# EAGLE design Tarjeta_Prototipo_L6470 (EAGLE 7.6.0)

## Sheet 1 of 7
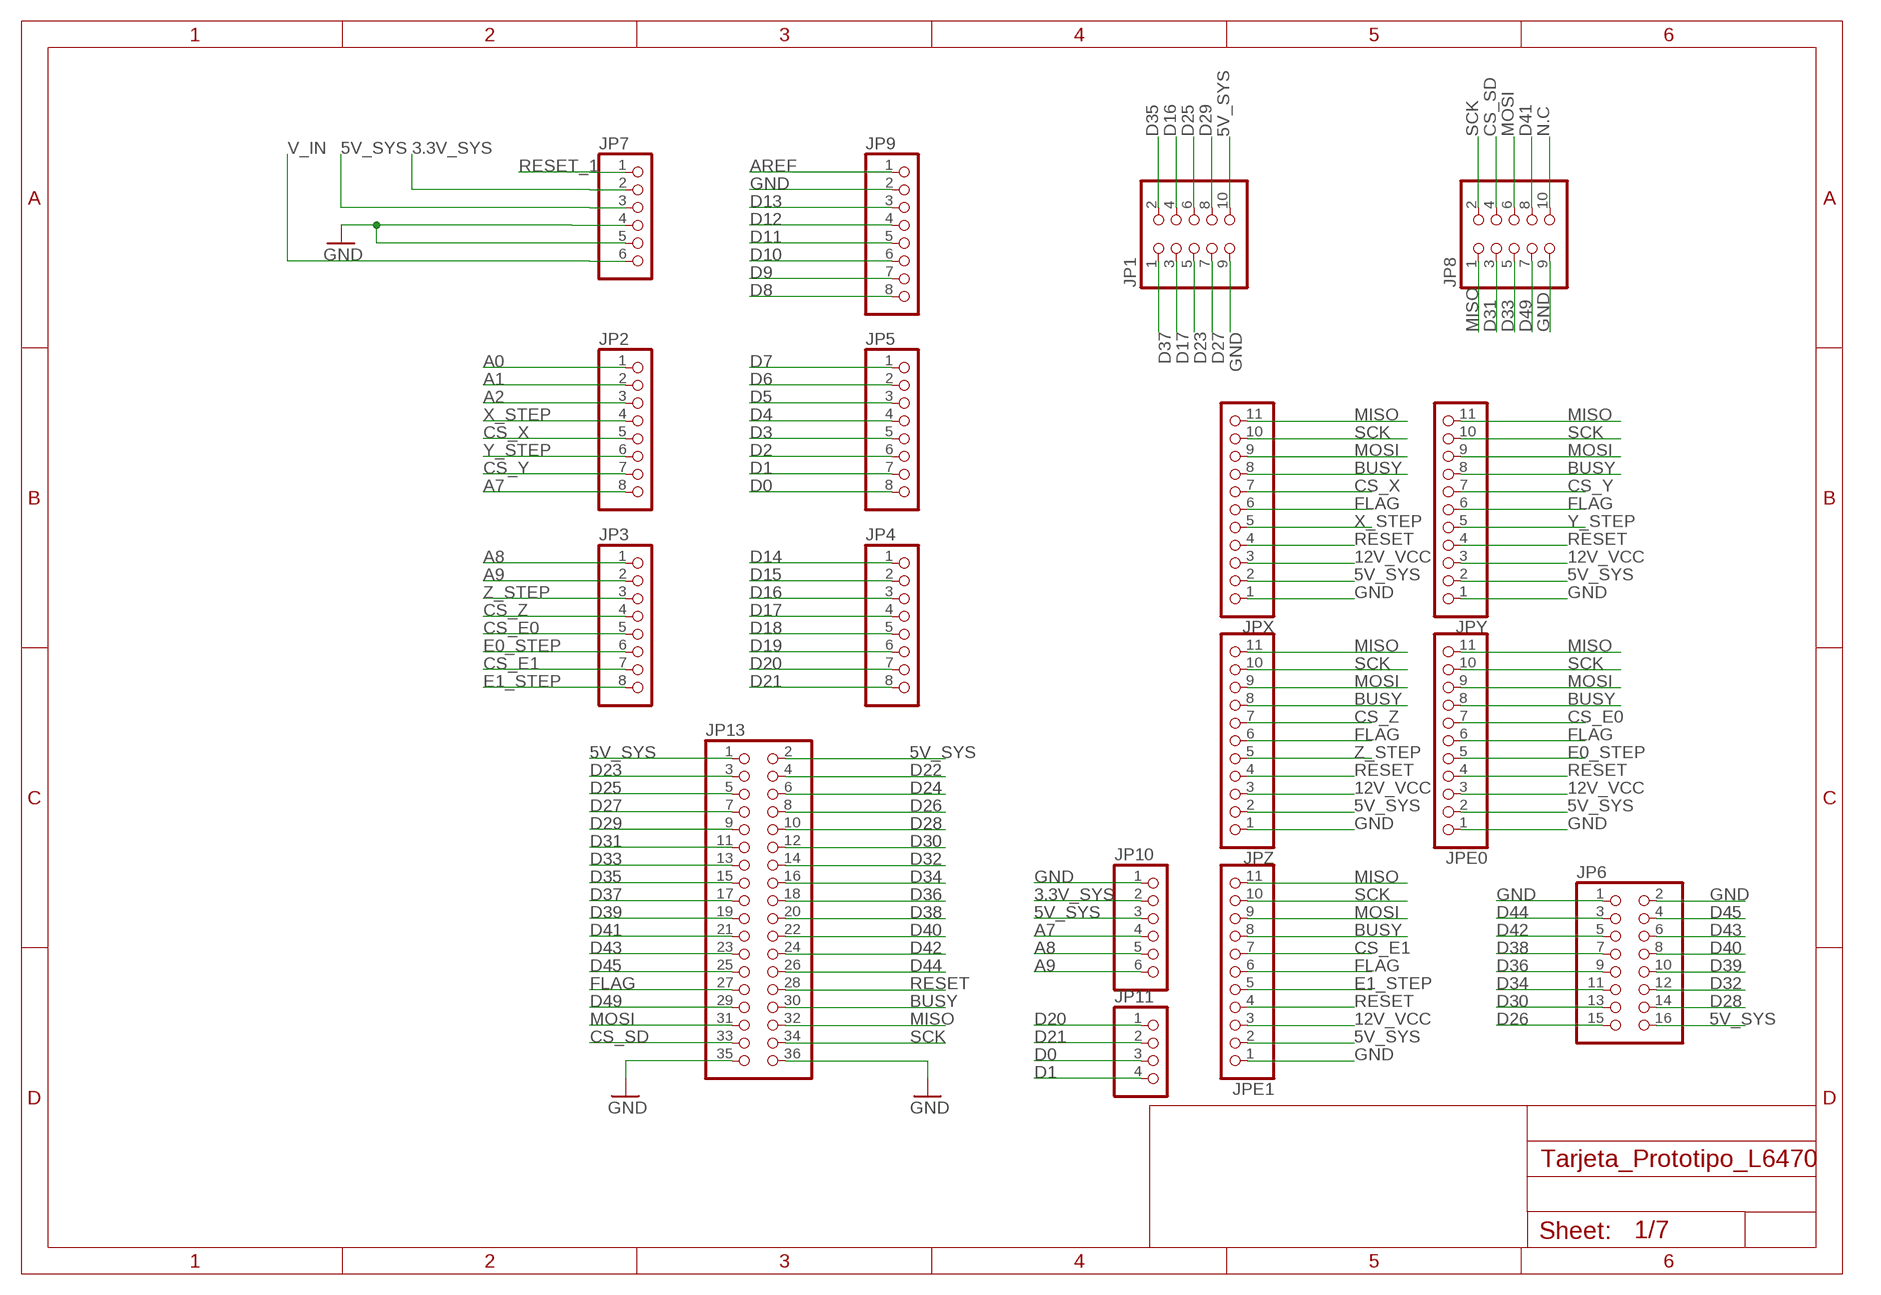
[diagram p0: schematic, sheet 1]

### Parts
JP1  PINHD-2X5  [2X05]
JP2  PINHD-1X8  [1X08]
JP3  PINHD-1X8  [1X08]
JP4  PINHD-1X8  [1X08]
JP5  PINHD-1X8  [1X08]
JP6  PINHD-2X8  [2X08]
JP7  PINHD-1X6  [1X06]
JP8  PINHD-2X5  [2X05]
JP9  PINHD-1X8  [1X08]
JP10  PINHD-1X6  [1X06]
JP11  PINHD-1X4  [1X04]
JP13  PINHD-2X18  [2X18]
JPE0  PINHD-1X11  [1X11]
JPE1  PINHD-1X11  [1X11]
JPX  PINHD-1X11  [1X11]
JPY  PINHD-1X11  [1X11]
JPZ  PINHD-1X11  [1X11]

### Nets
3.3V_SYS: JP7.2 JP10.2
5V_SYS: JP1.10 JP6.16 JP7.3 JP10.3 JP13.1 JP13.2 JPE0.2 JPE1.2 JPX.2 JPY.2 JPZ.2 ; also sheet 3
12V_VCC: JPE0.3 JPE1.3 JPX.3 JPY.3 JPZ.3 ; also sheet 2,5,7
A0: JP2.1 ; also sheet 3
A1: JP2.2 ; also sheet 3
A2: JP2.3 ; also sheet 3
A7: JP2.8 JP10.4
A8: JP3.1 JP10.5
A9: JP3.2 JP10.6
AREF: JP9.1
BUSY: JP13.30 JPE0.8 JPE1.8 JPX.8 JPY.8 JPZ.8
CS_E0: JP3.5 JPE0.7
CS_E1: JP3.7 JPE1.7
CS_SD: JP8.4 JP13.33
CS_X: JP2.5 JPX.7
CS_Y: JP2.7 JPY.7
CS_Z: JP3.4 JPZ.7
D0: JP5.8 JP11.3
D1: JP5.7 JP11.4
D2: JP5.6 ; also sheet 6
D3: JP5.5 ; also sheet 6
D4: JP5.4 ; also sheet 6
D5: JP5.3 ; also sheet 6
D6: JP5.2 ; also sheet 4
D7: JP5.1 ; also sheet 4
D8: JP9.8 ; also sheet 4
D9: JP9.7 ; also sheet 3
D10: JP9.6 ; also sheet 3
D11: JP9.5 ; also sheet 3
D12: JP9.4 ; also sheet 3
D13: JP9.3 ; also sheet 2
D14: JP4.1 ; also sheet 3
D15: JP4.2 ; also sheet 3
D16: JP1.4 JP4.3
D17: JP1.3 JP4.4
D18: JP4.5 ; also sheet 3
D19: JP4.6 ; also sheet 3
D20: JP4.7 JP11.1
D21: JP4.8 JP11.2
D22: JP13.4 ; also sheet 3
D23: JP1.5 JP13.3
D24: JP13.6 ; also sheet 3
D25: JP1.6 JP13.5
D26: JP6.15 JP13.8
D27: JP1.7 JP13.7
D28: JP6.14 JP13.10
D29: JP1.8 JP13.9
D30: JP6.13 JP13.12
D31: JP8.3 JP13.11
D32: JP6.12 JP13.14
D33: JP8.5 JP13.13
D34: JP6.11 JP13.16
D35: JP1.2 JP13.15
D36: JP6.9 JP13.18
D37: JP1.1 JP13.17
D38: JP6.7 JP13.20
D39: JP6.10 JP13.19
D40: JP6.8 JP13.22
D41: JP8.8 JP13.21
D42: JP6.5 JP13.24
D43: JP6.6 JP13.23
D44: JP6.3 JP13.26
D45: JP6.4 JP13.25
D49: JP8.7 JP13.29
E0_STEP: JP3.6 JPE0.5
E1_STEP: JP3.8 JPE1.5
FLAG: JP13.27 JPE0.6 JPE1.6 JPX.6 JPY.6 JPZ.6
GND: JP1.9 JP6.1 JP6.2 JP7.4 JP7.5 JP8.9 JP9.2 JP10.1 JP13.35 JP13.36 JPE0.1 JPE1.1 JPX.1 JPY.1 JPZ.1 ; also sheet 2,3,4,5,6,7
MISO: JP8.1 JP13.32 JPE0.11 JPE1.11 JPX.11 JPY.11 JPZ.11
MOSI: JP8.6 JP13.31 JPE0.9 JPE1.9 JPX.9 JPY.9 JPZ.9
N.C: JP8.10
RESET: JP13.28 JPE0.4 JPE1.4 JPX.4 JPY.4 JPZ.4
RESET_1: JP7.1 ; also sheet 2
SCK: JP8.2 JP13.34 JPE0.10 JPE1.10 JPX.10 JPY.10 JPZ.10
V_IN: JP7.6 ; also sheet 2,4,6
X_STEP: JP2.4 JPX.5
Y_STEP: JP2.6 JPY.5
Z_STEP: JP3.3 JPZ.5

## Sheet 2 of 7
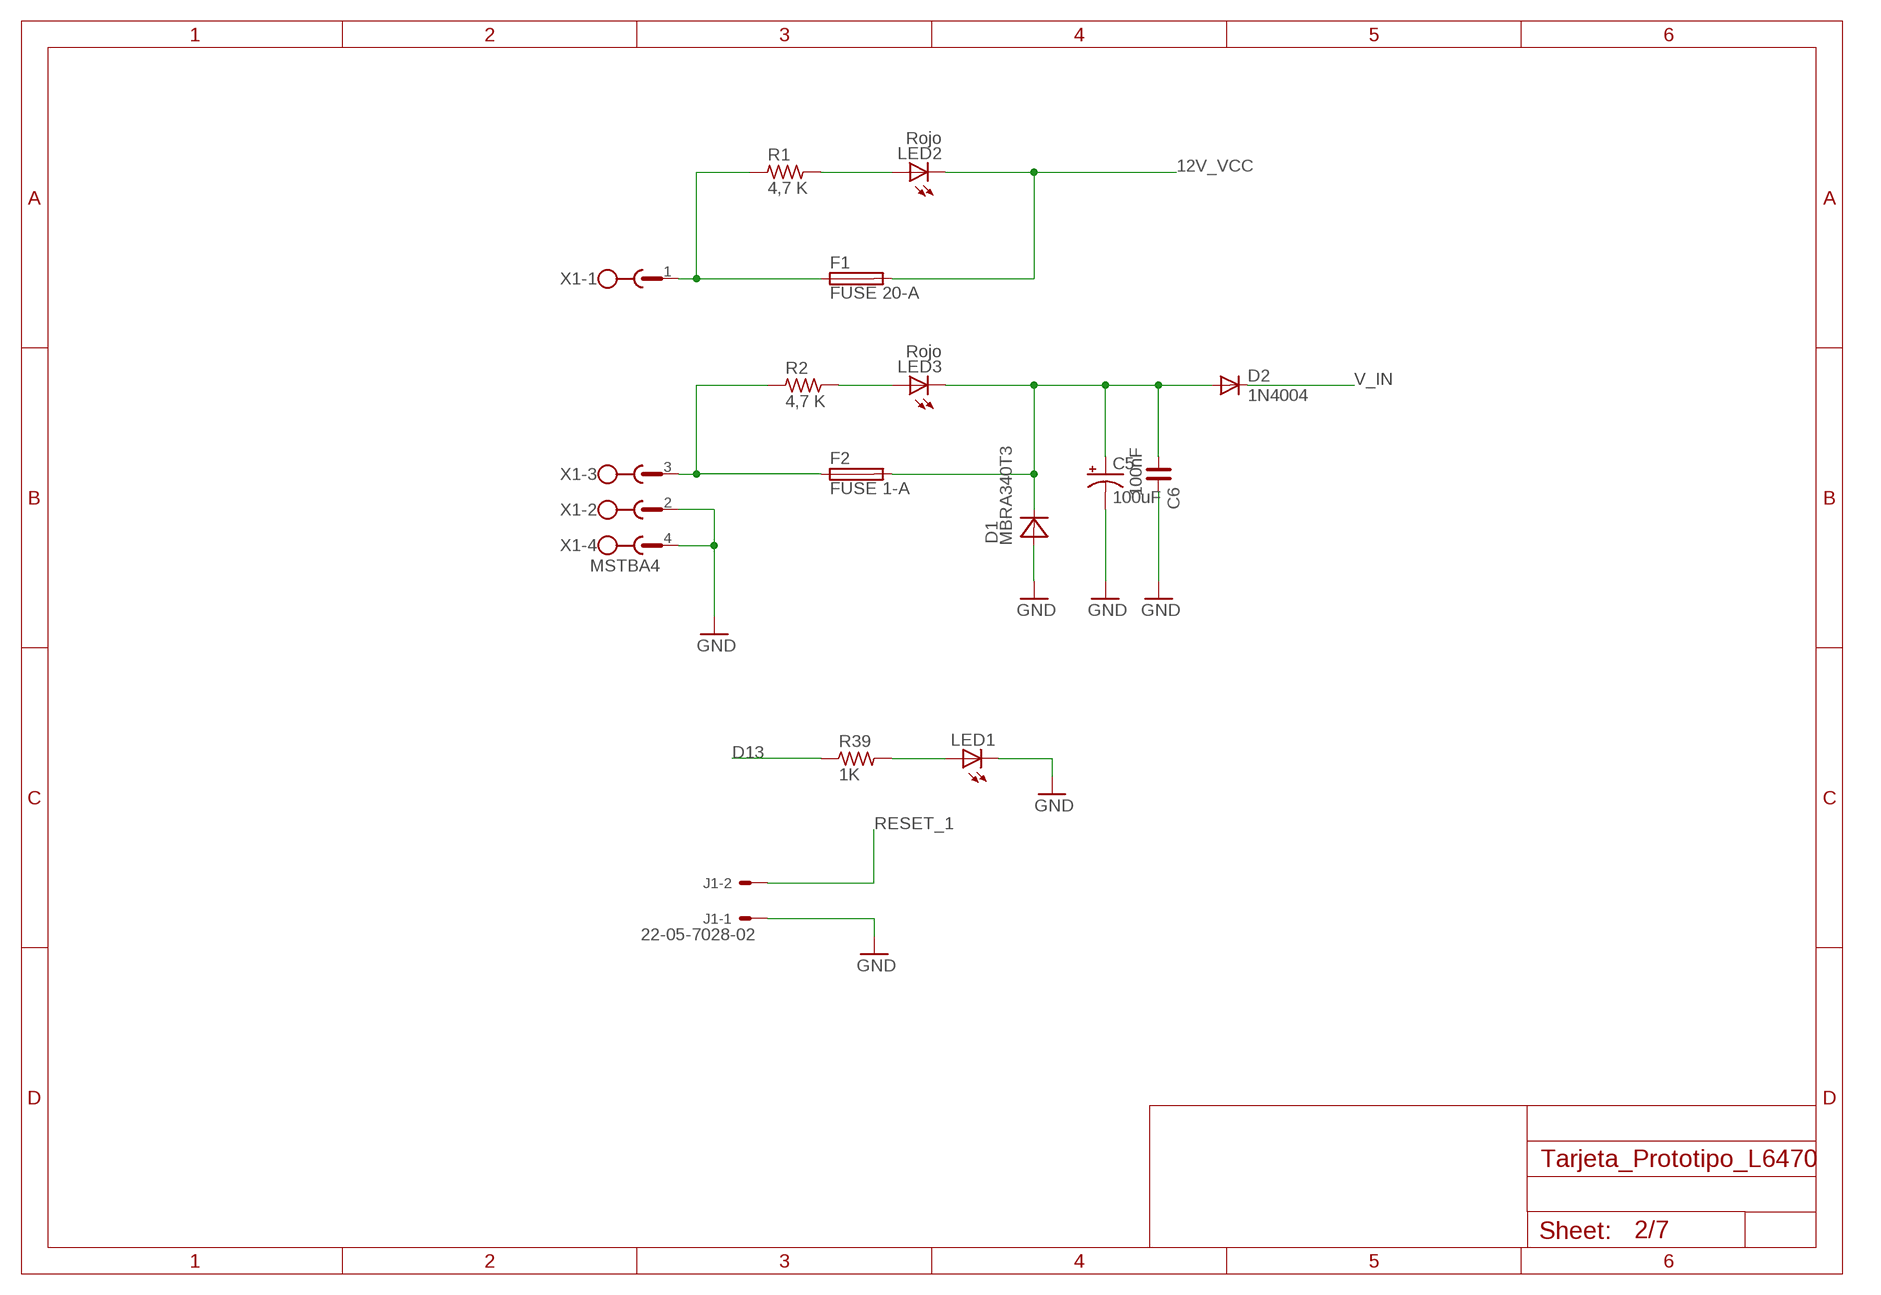
[diagram p1: schematic, sheet 2]

### Parts
C5  100uF  CPOL-US153CLV-0605  [153CLV-0605]
C6  100nF  C_1206  [C1206]
D1  MBRA340T3  [SMA]
D2  1N4004  [DO41-10]
F1  FUSE 20-A  FUSE  [3557]
F2  FUSE 1-A  FUSE  [3557]
J1  22-05-7028-02  [7395-02]
LED1  LEDSMT1206  [1206]
LED2  Rojo  LEDSMT1206  [1206]
LED3  Rojo  LEDSMT1206  [1206]
R1  4,7 K  R_1206  [R1206]
R2  4,7 K  R_1206  [R1206]
R39  1K  R_1206  [R1206]
X1  MSTBA4  [MSTBA4]

### Nets
12V_IN1: F1.P$1 F1.P$2 R1.1 X1.1
12V_IN2: F2.P$1 F2.P$2 R2.1 X1.3
12V_VCC: F1.P$3 F1.P$4 LED2.C ; also sheet 1,5,7
D13: R39.1 ; also sheet 1
GND: C5.- C6.2 D1.A J1.1 LED1.C X1.2 X1.4 ; also sheet 1,3,4,5,6,7
N$2: LED1.A R39.2
N$4: LED2.A R1.2
N$6: LED3.A R2.2
N$9: C5.+ C6.1 D1.C D2.A F2.P$3 F2.P$4 LED3.C
RESET_1: J1.2 ; also sheet 1
V_IN: D2.C ; also sheet 1,4,6

## Sheet 3 of 7
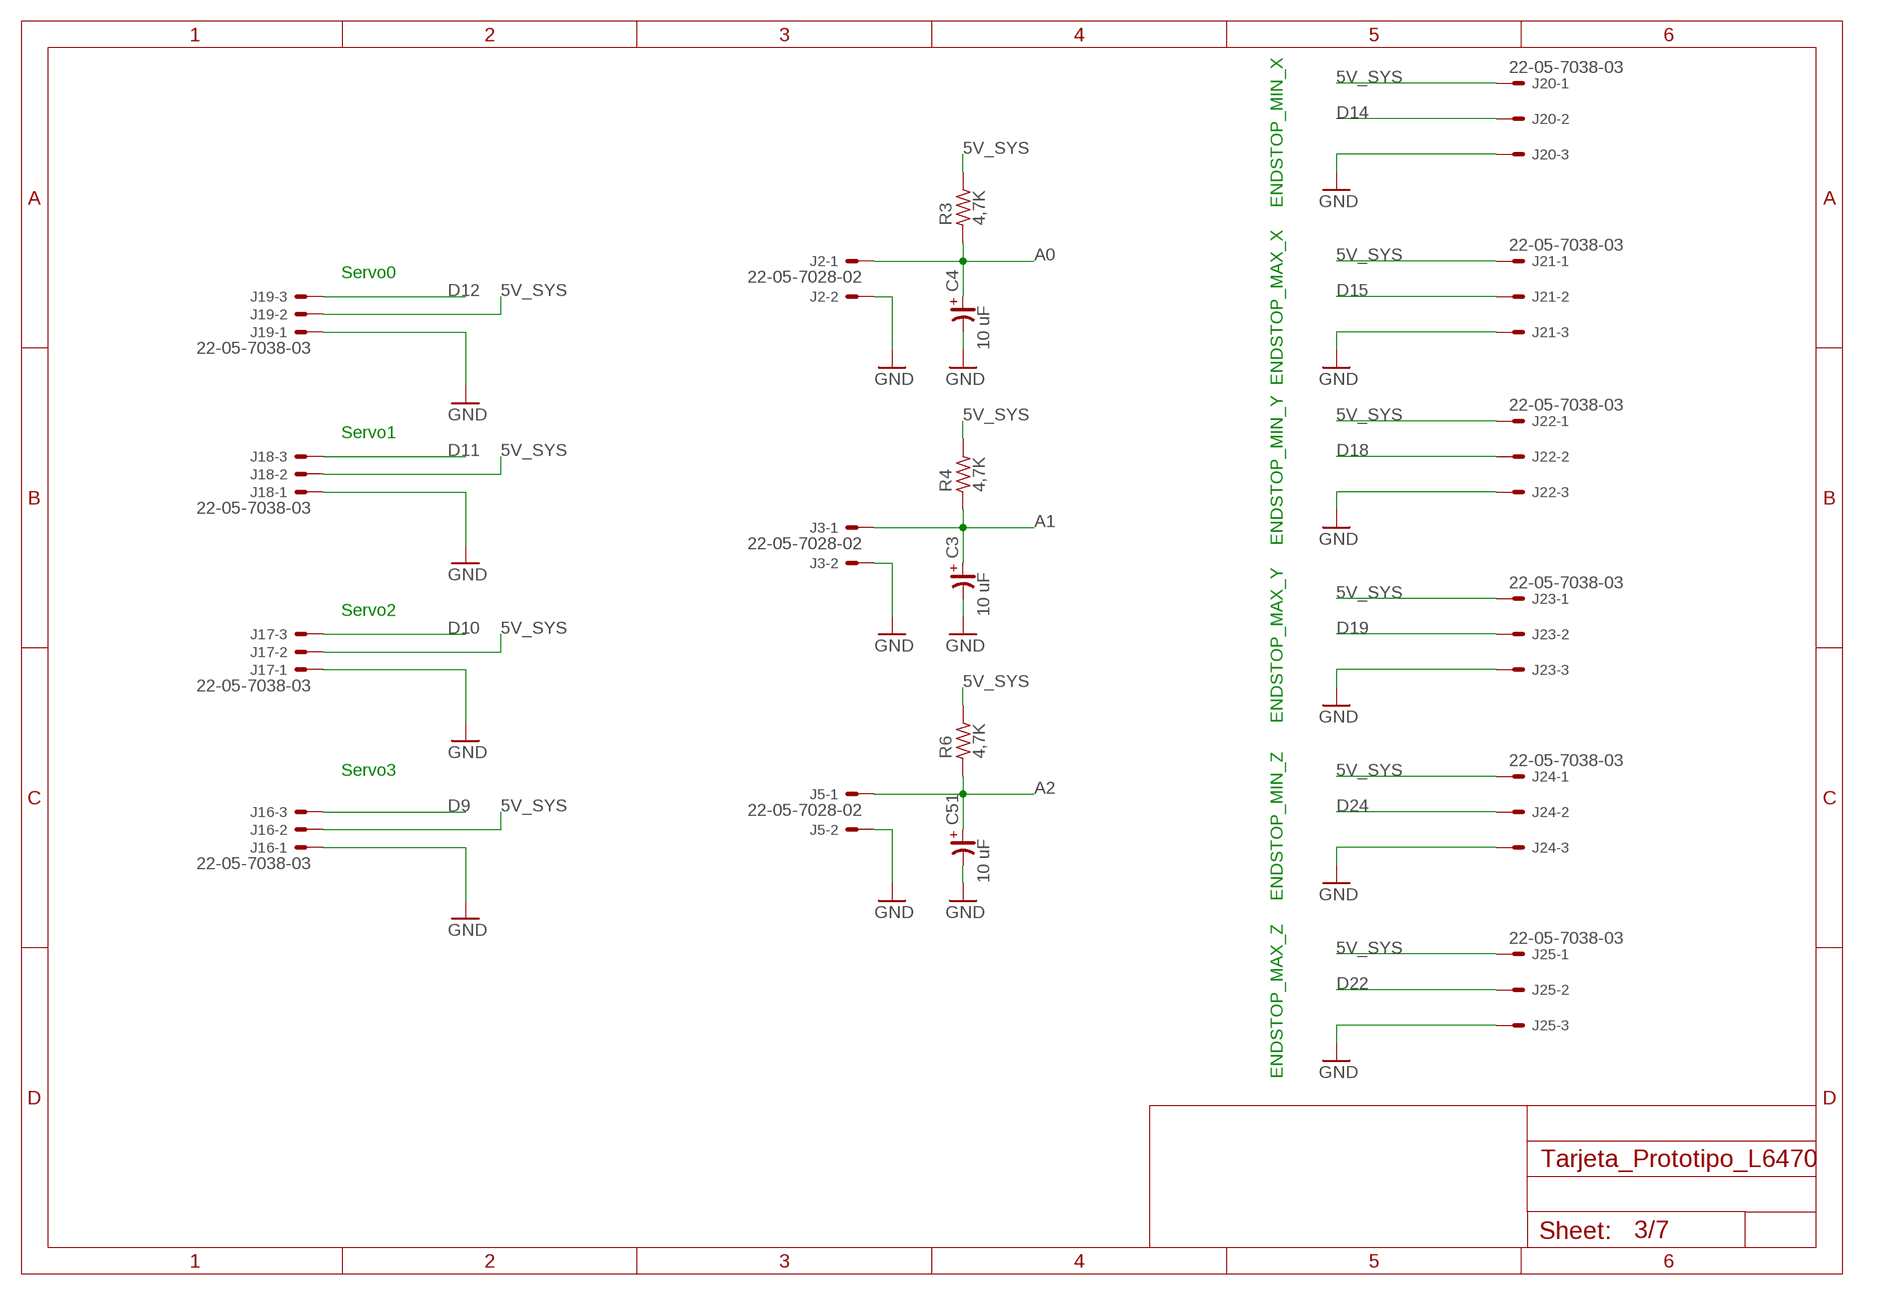
[diagram p2: schematic, sheet 3]

### Parts
C3  10 uF  CP_SV-B  [CSV-B]
C4  10 uF  CP_SV-B  [CSV-B]
C51  10 uF  CP_SV-B  [CSV-B]
J2  22-05-7028-02  [7395-02]
J3  22-05-7028-02  [7395-02]
J5  22-05-7028-02  [7395-02]
J16  22-05-7038-03  [7395-03]
J17  22-05-7038-03  [7395-03]
J18  22-05-7038-03  [7395-03]
J19  22-05-7038-03  [7395-03]
J20  22-05-7038-03  [7395-03]
J21  22-05-7038-03  [7395-03]
J22  22-05-7038-03  [7395-03]
J23  22-05-7038-03  [7395-03]
J24  22-05-7038-03  [7395-03]
J25  22-05-7038-03  [7395-03]
R3  4,7K  R_1206  [R1206]
R4  4,7K  R_1206  [R1206]
R6  4,7K  R_1206  [R1206]

### Nets
5V_SYS: J16.2 J17.2 J18.2 J19.2 J20.1 J21.1 J22.1 J23.1 J24.1 J25.1 R3.2 R4.2 R6.2 ; also sheet 1
A0: C4.+ J2.1 R3.1 ; also sheet 1
A1: C3.+ J3.1 R4.1 ; also sheet 1
A2: C51.+ J5.1 R6.1 ; also sheet 1
D9: J16.3 ; also sheet 1
D10: J17.3 ; also sheet 1
D11: J18.3 ; also sheet 1
D12: J19.3 ; also sheet 1
D14: J20.2 ; also sheet 1
D15: J21.2 ; also sheet 1
D18: J22.2 ; also sheet 1
D19: J23.2 ; also sheet 1
D22: J25.2 ; also sheet 1
D24: J24.2 ; also sheet 1
GND: C3.- C4.- C51.- J2.2 J3.2 J5.2 J16.1 J17.1 J18.1 J19.1 J20.3 J21.3 J22.3 J23.3 J24.3 J25.3 ; also sheet 1,2,4,5,6,7

### Notes on the sheet
- ENDSTOP_MIN_X
- Servo0
- ENDSTOP_MAX_X
- Servo1
- ENDSTOP_MIN_Y
- Servo2
- ENDSTOP_MAX_Y
- Servo3
- ENDSTOP_MIN_Z
- ENDSTOP_MAX_Z

## Sheet 4 of 7
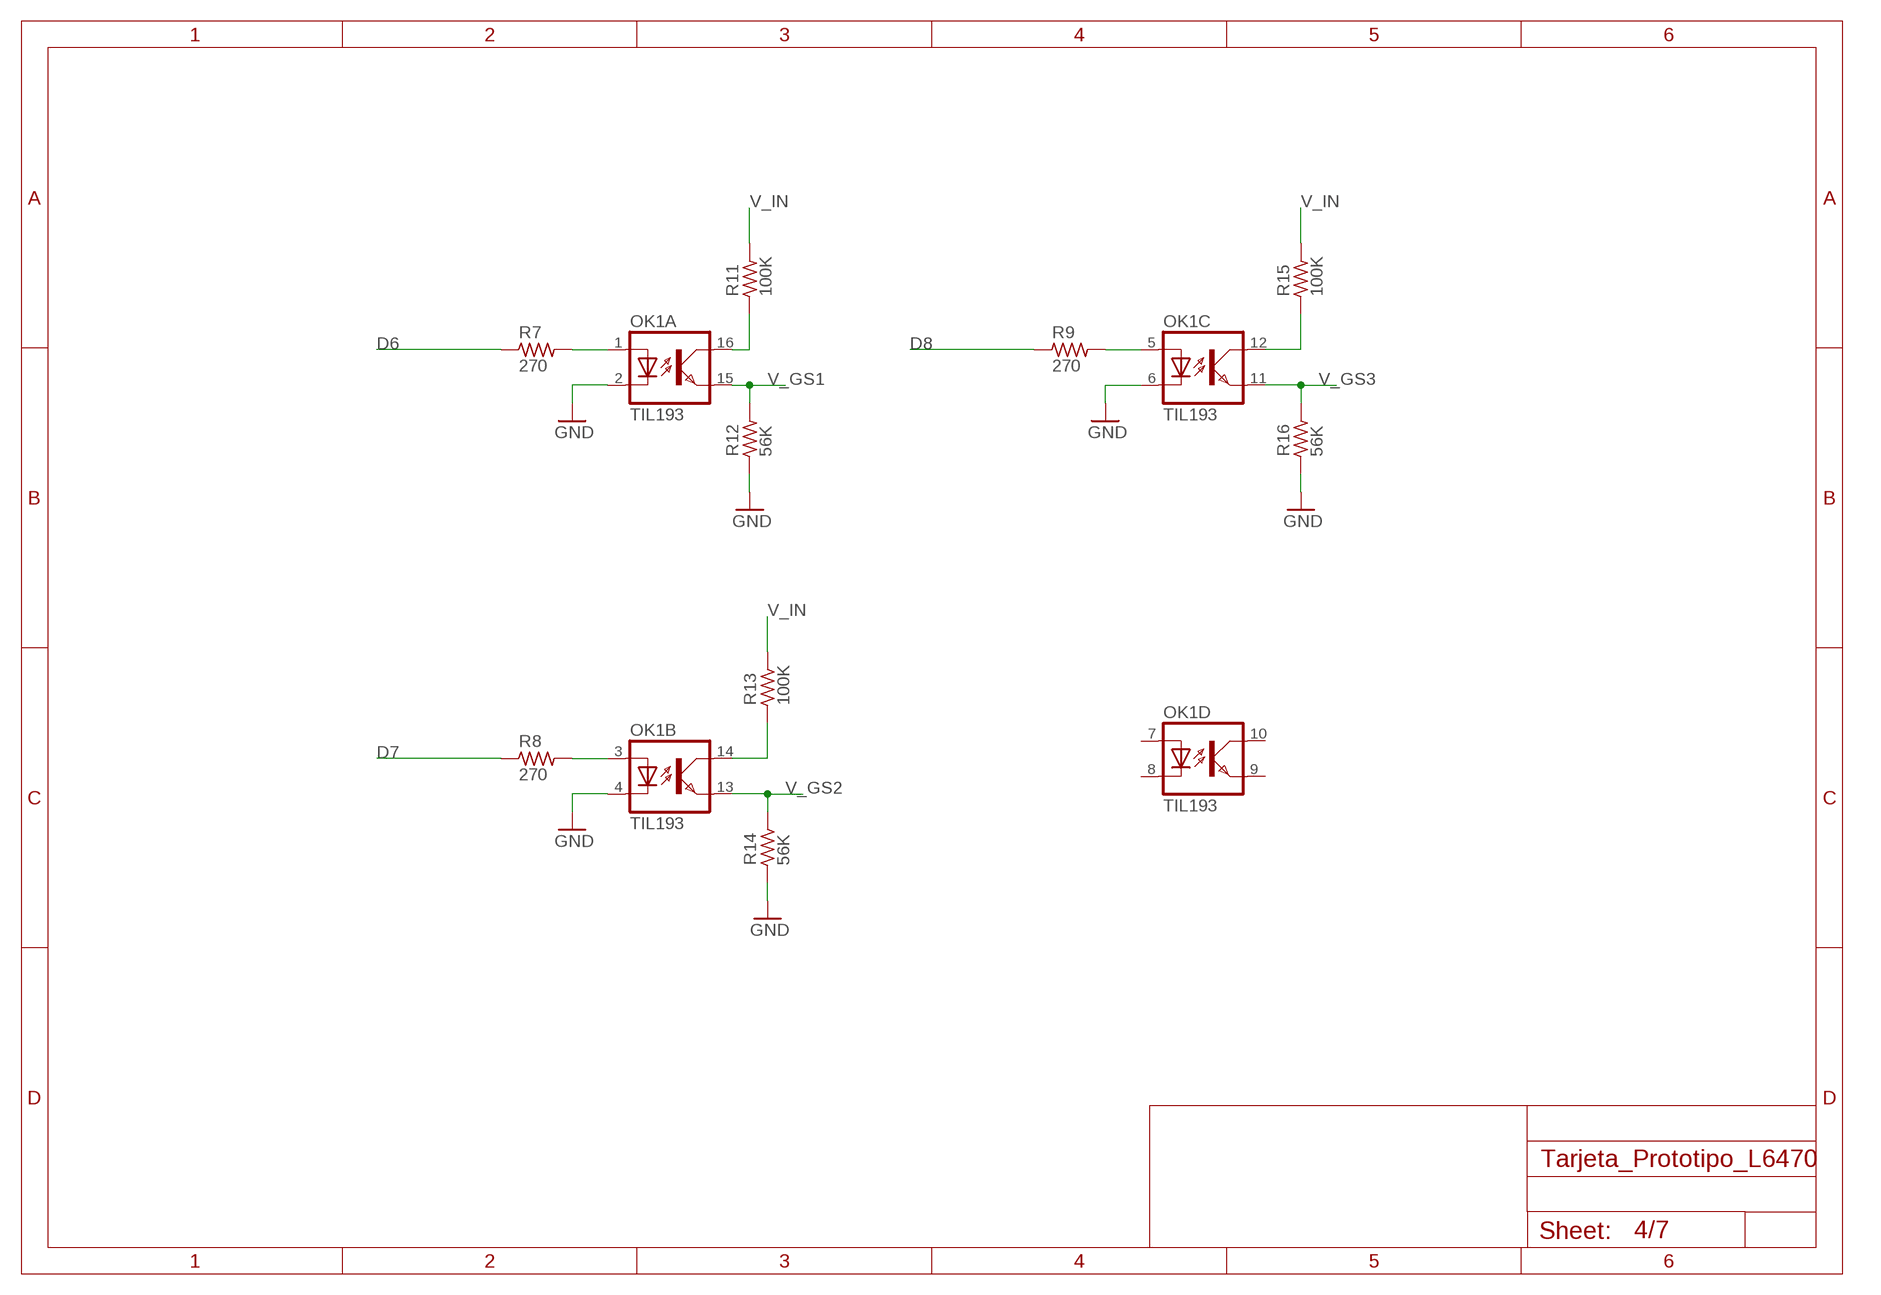
[diagram p3: schematic, sheet 4]

### Parts
OK1  TIL193  [DIL16]
R7  270  R_1206  [R1206]
R8  270  R_1206  [R1206]
R9  270  R_1206  [R1206]
R11  100K  R_1206  [R1206]
R12  56K  R_1206  [R1206]
R13  100K  R_1206  [R1206]
R14  56K  R_1206  [R1206]
R15  100K  R_1206  [R1206]
R16  56K  R_1206  [R1206]

### Nets
D6: R7.1 ; also sheet 1
D7: R8.1 ; also sheet 1
D8: R9.1 ; also sheet 1
GND: OK1.2(A:C) OK1.4(B:C) OK1.6(C:C) R12.1 R14.1 R16.1 ; also sheet 1,2,3,5,6,7
N$10: OK1.1(A:A) R7.2
N$11: OK1.3(B:A) R8.2
N$12: OK1.5(C:A) R9.2
N$14: OK1.16(A:COL) R11.1
N$15: OK1.14(B:COL) R13.1
N$16: OK1.12(C:COL) R15.1
V_GS1: OK1.15(A:EMIT) R12.2 ; also sheet 5
V_GS2: OK1.13(B:EMIT) R14.2 ; also sheet 5
V_GS3: OK1.11(C:EMIT) R16.2 ; also sheet 5
V_IN: R11.2 R13.2 R15.2 ; also sheet 1,2,6
Unconnected: OK1.7(D:A) OK1.8(D:C) OK1.9(D:EMIT) OK1.10(D:COL)

## Sheet 5 of 7
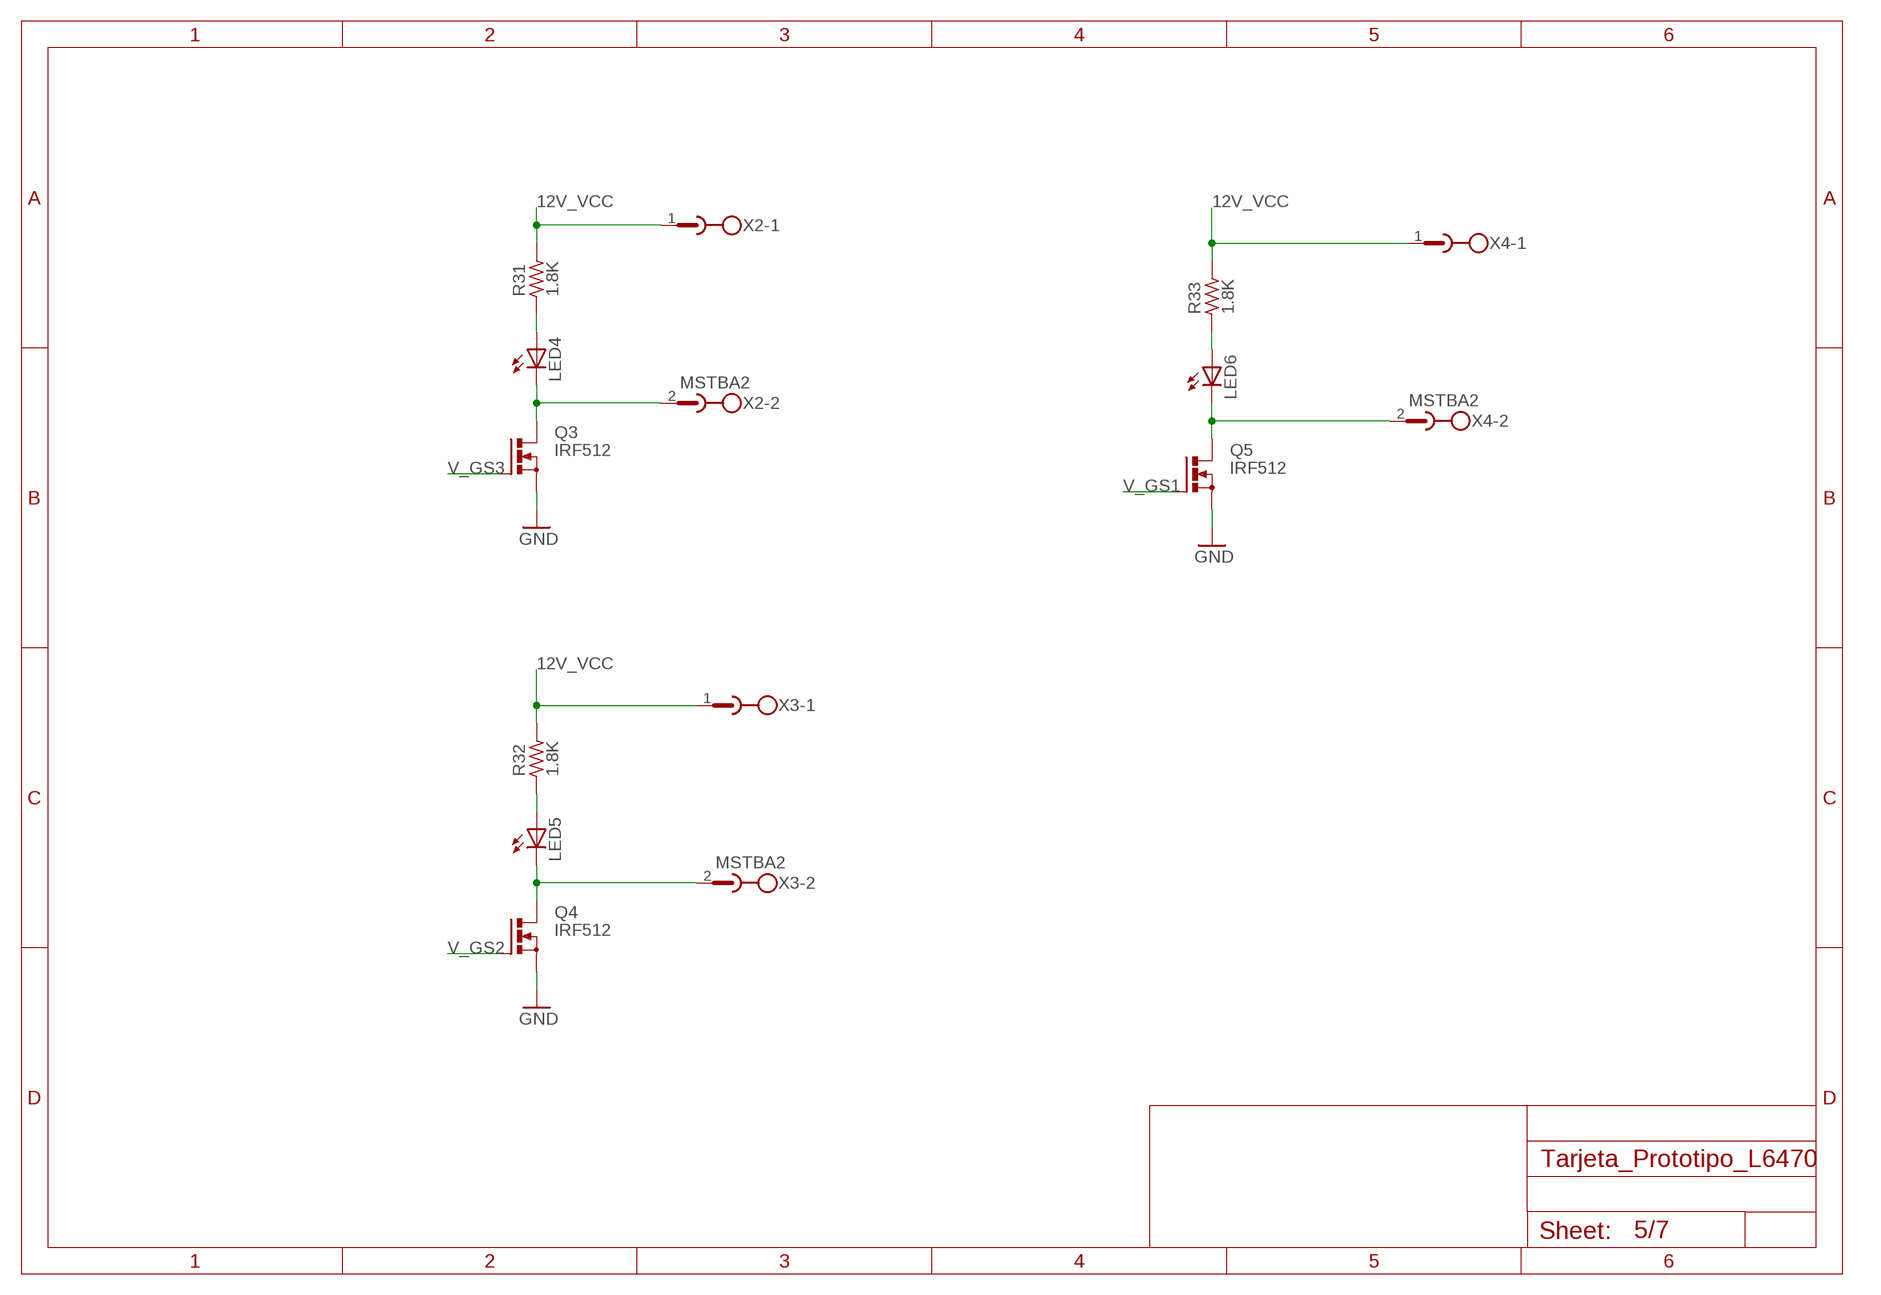
[diagram p4: schematic, sheet 5]

### Parts
LED4  LEDSMT1206  [1206]
LED5  LEDSMT1206  [1206]
LED6  LEDSMT1206  [1206]
Q3  IRF512  [TO220BV]
Q4  IRF512  [TO220BV]
Q5  IRF512  [TO220BV]
R31  1.8K  R_1206  [R1206]
R32  1.8K  R_1206  [R1206]
R33  1.8K  R_1206  [R1206]
X2  MSTBA2  [MSTBA2]
X3  MSTBA2  [MSTBA2]
X4  MSTBA2  [MSTBA2]

### Nets
12V_VCC: R31.2 R32.2 R33.2 X2.1 X3.1 X4.1 ; also sheet 1,2,7
GND: Q3.S Q4.S Q5.S ; also sheet 1,2,3,4,6,7
N$8: LED6.C Q5.D X4.2
N$26: LED4.A R31.1
N$27: LED5.C Q4.D X3.2
N$28: LED5.A R32.1
N$30: LED6.A R33.1
N$66: LED4.C Q3.D X2.2
V_GS1: Q5.G ; also sheet 4
V_GS2: Q4.G ; also sheet 4
V_GS3: Q3.G ; also sheet 4

## Sheet 6 of 7
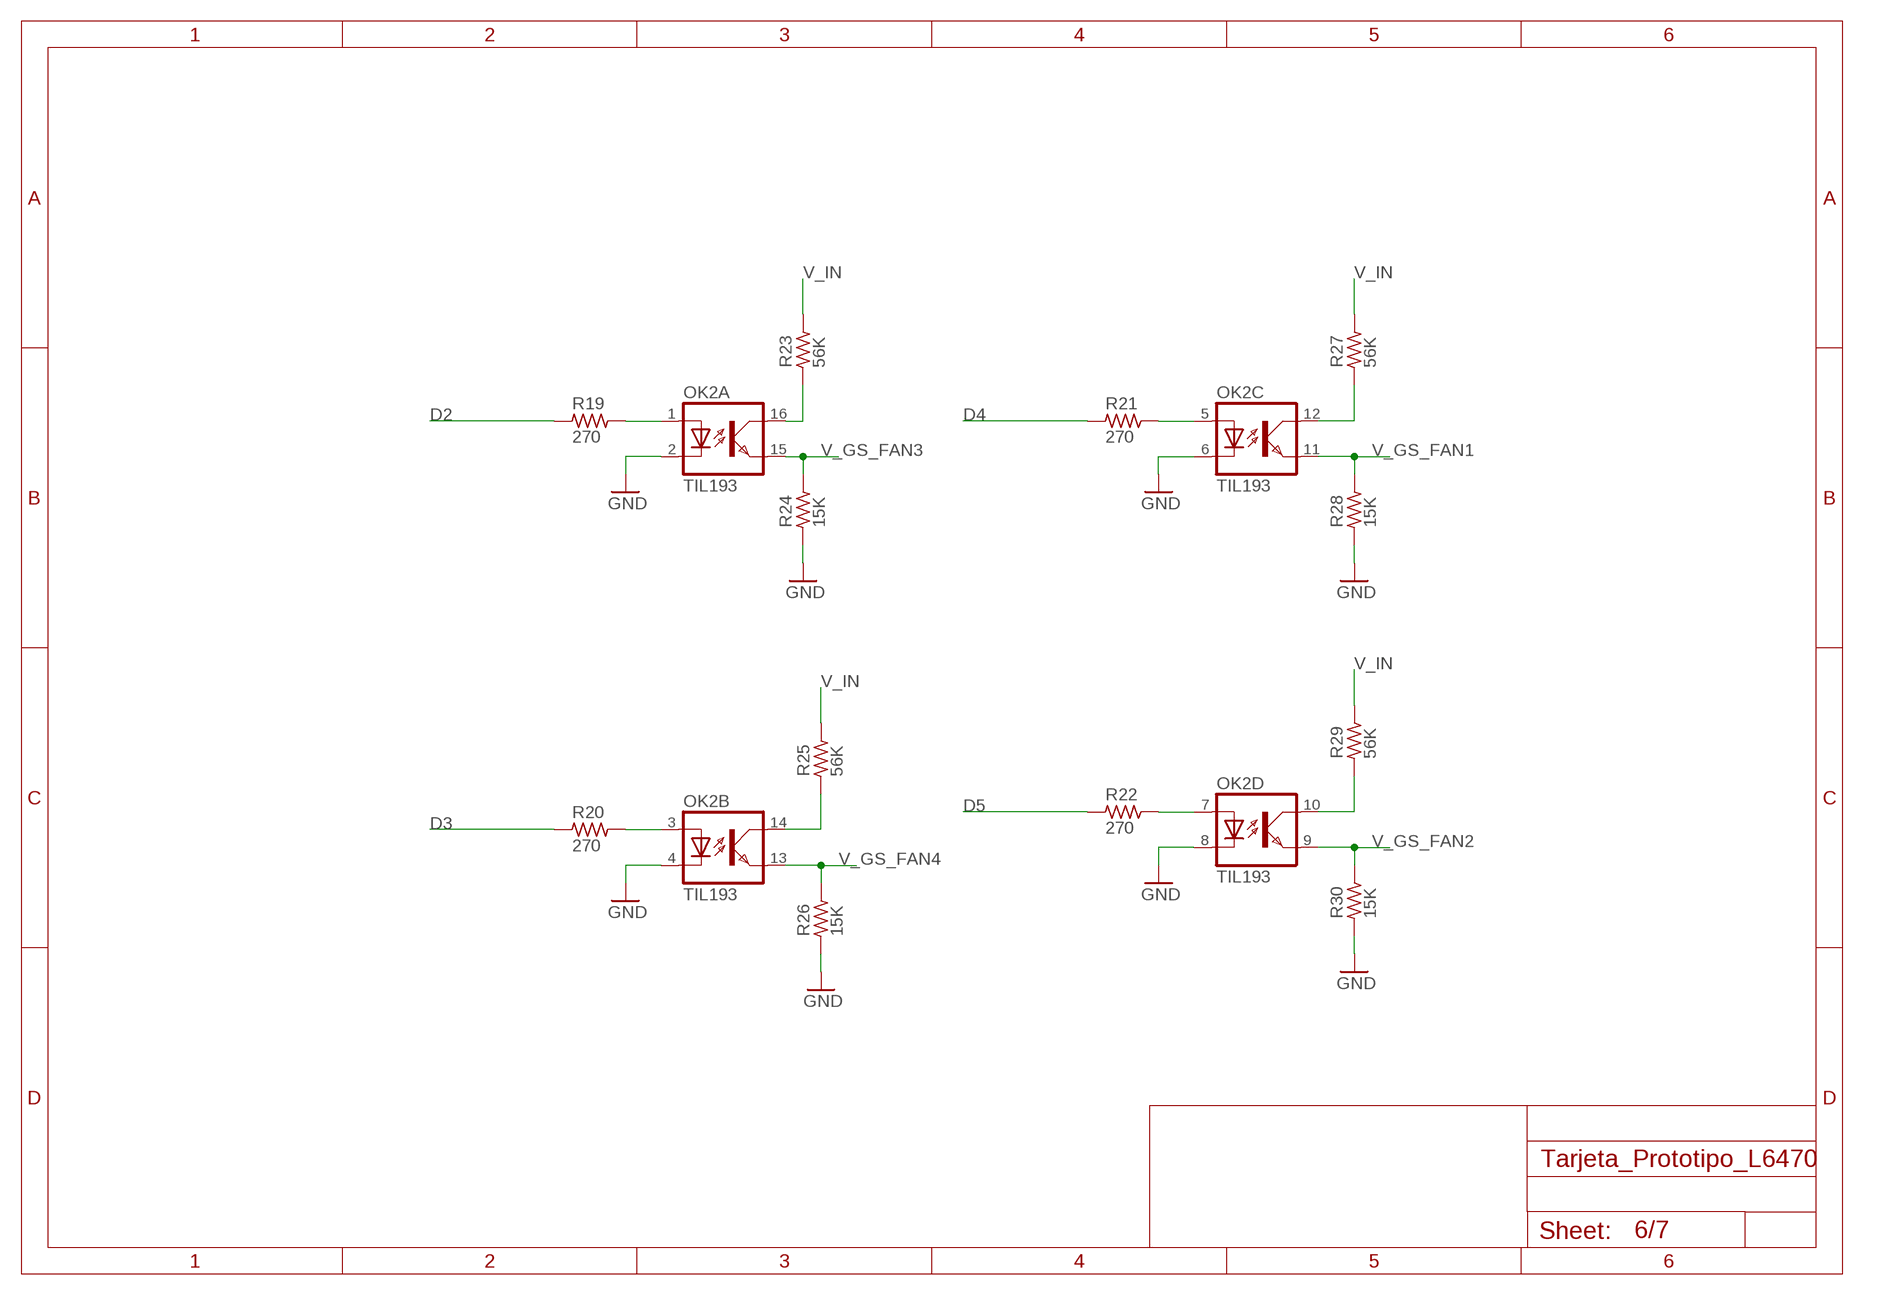
[diagram p5: schematic, sheet 6]

### Parts
OK2  TIL193  [DIL16]
R19  270  R_1206  [R1206]
R20  270  R_1206  [R1206]
R21  270  R_1206  [R1206]
R22  270  R_1206  [R1206]
R23  56K  R_1206  [R1206]
R24  15K  R_1206  [R1206]
R25  56K  R_1206  [R1206]
R26  15K  R_1206  [R1206]
R27  56K  R_1206  [R1206]
R28  15K  R_1206  [R1206]
R29  56K  R_1206  [R1206]
R30  15K  R_1206  [R1206]

### Nets
D2: R19.1 ; also sheet 1
D3: R20.1 ; also sheet 1
D4: R21.1 ; also sheet 1
D5: R22.1 ; also sheet 1
GND: OK2.2(A:C) OK2.4(B:C) OK2.6(C:C) OK2.8(D:C) R24.1 R26.1 R28.1 R30.1 ; also sheet 1,2,3,4,5,7
N$18: OK2.1(A:A) R19.2
N$19: OK2.3(B:A) R20.2
N$20: OK2.5(C:A) R21.2
N$21: OK2.7(D:A) R22.2
N$22: OK2.16(A:COL) R23.1
N$23: OK2.14(B:COL) R25.1
N$24: OK2.12(C:COL) R27.1
N$25: OK2.10(D:COL) R29.1
V_GS_FAN1: OK2.11(C:EMIT) R28.2 ; also sheet 7
V_GS_FAN2: OK2.9(D:EMIT) R30.2 ; also sheet 7
V_GS_FAN3: OK2.15(A:EMIT) R24.2 ; also sheet 7
V_GS_FAN4: OK2.13(B:EMIT) R26.2 ; also sheet 7
V_IN: R23.2 R25.2 R27.2 R29.2 ; also sheet 1,2,4

## Sheet 7 of 7
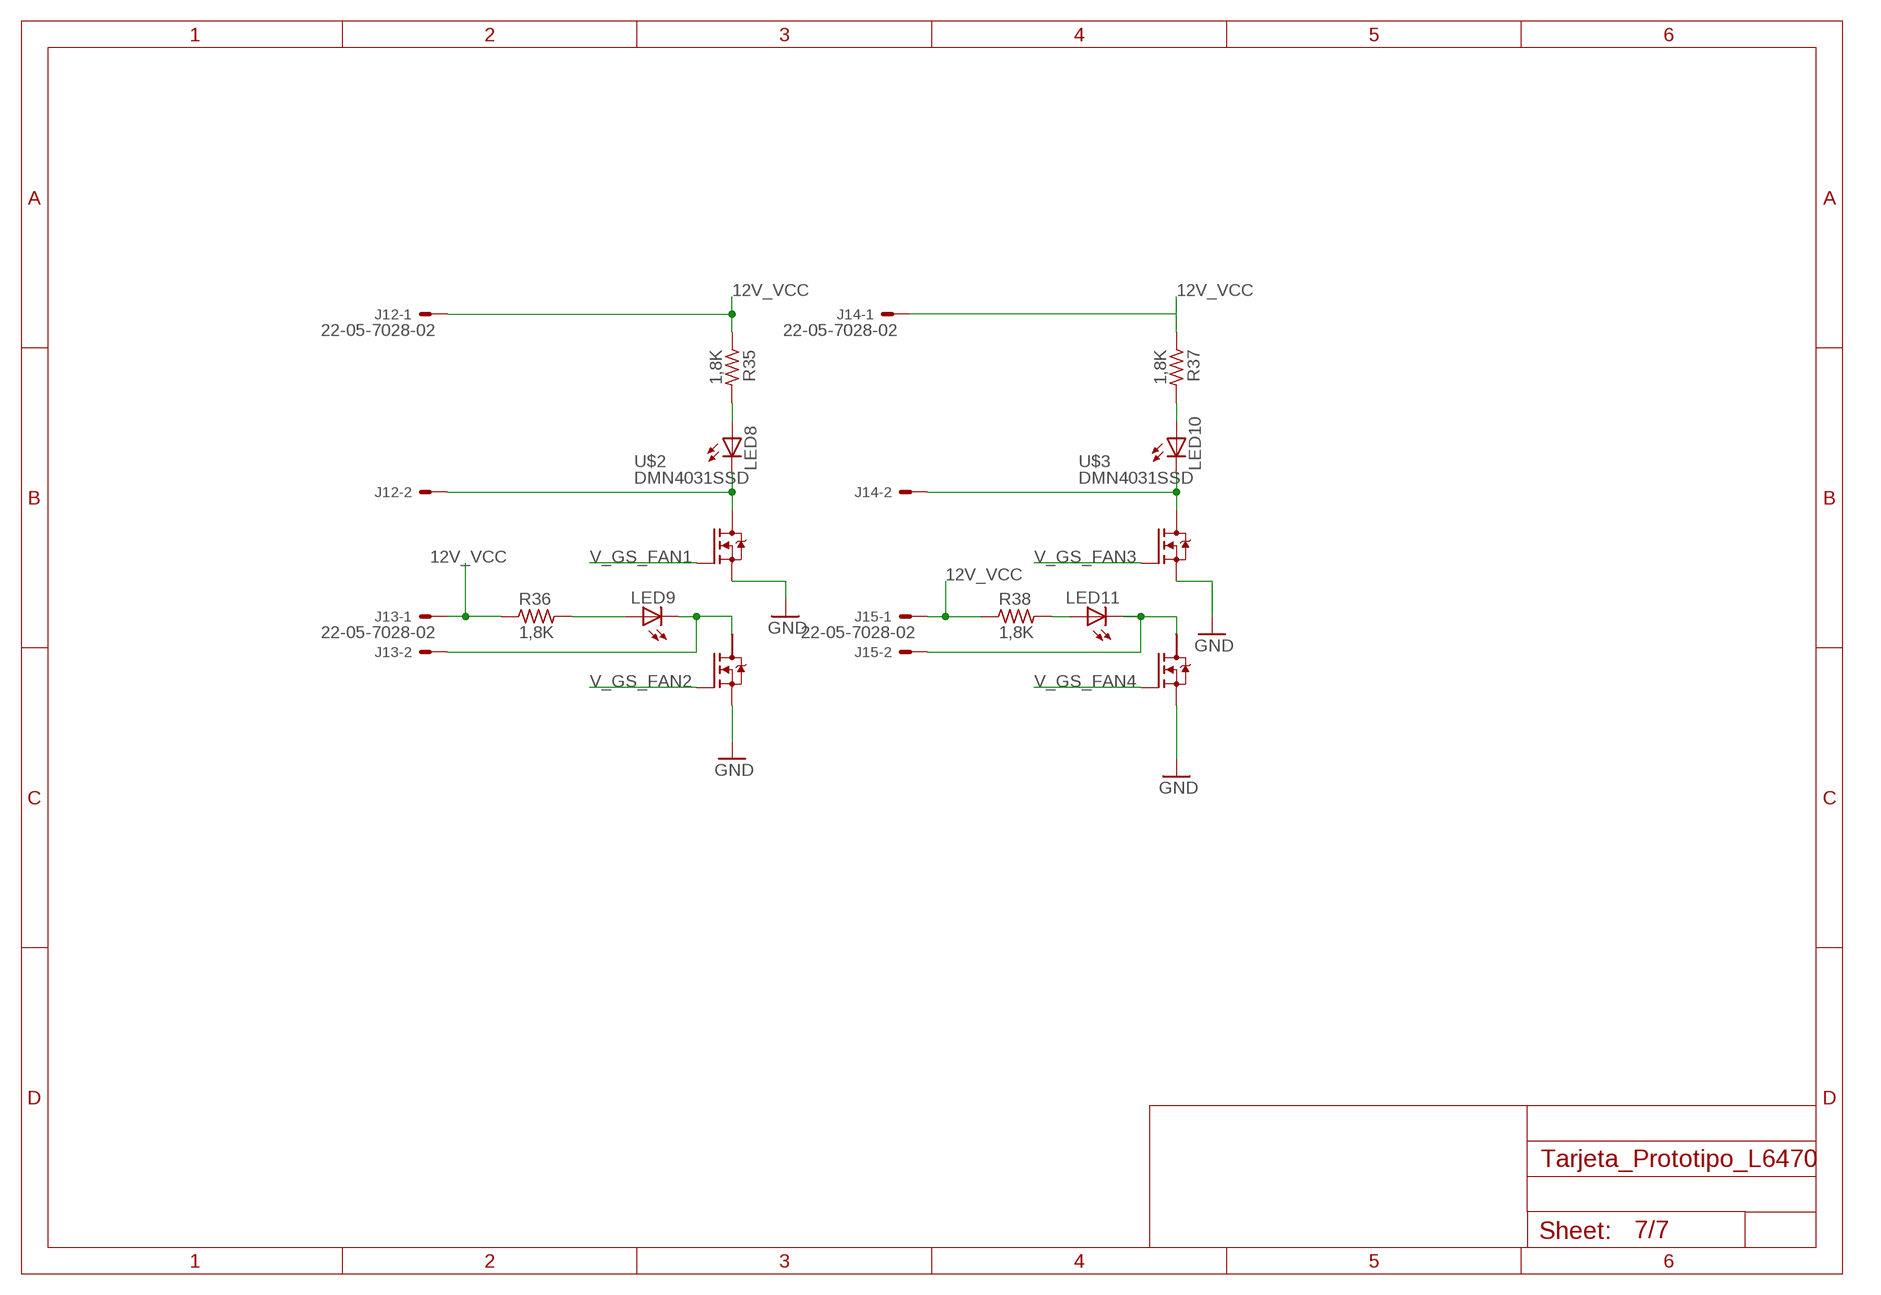
[diagram p6: schematic, sheet 7]

### Parts
J12  22-05-7028-02  [7395-02]
J13  22-05-7028-02  [7395-02]
J14  22-05-7028-02  [7395-02]
J15  22-05-7028-02  [7395-02]
LED8  LEDSMT1206  [1206]
LED9  LEDSMT1206  [1206]
LED10  LEDSMT1206  [1206]
LED11  LEDSMT1206  [1206]
R35  1,8K  R_1206  [R1206]
R36  1,8K  R_1206  [R1206]
R37  1,8K  R_1206  [R1206]
R38  1,8K  R_1206  [R1206]
U$2  DMN4031SSD  [DMN4031SSD]
U$3  DMN4031SSD  [DMN4031SSD]

### Nets
12V_VCC: J12.1 J13.1 J14.1 J15.1 R35.1 R36.1 R37.1 R38.1 ; also sheet 1,2,5
GND: U$2.1(S2) U$2.3(S1) U$3.1(S2) U$3.3(S1) ; also sheet 1,2,3,4,5,6
N$1: LED11.A R38.2
N$29: J15.2 LED11.C U$3.7(D2) U$3.8(D2)
N$33: LED9.A R36.2
N$34: J13.2 LED9.C U$2.7(D2) U$2.8(D2)
N$35: LED8.A R35.2
N$36: J14.2 LED10.C U$3.5(D1) U$3.6(D1)
N$39: J12.2 LED8.C U$2.5(D1) U$2.6(D1)
N$42: LED10.A R37.2
V_GS_FAN1: U$2.4(G1) ; also sheet 6
V_GS_FAN2: U$2.2(G2) ; also sheet 6
V_GS_FAN3: U$3.4(G1) ; also sheet 6
V_GS_FAN4: U$3.2(G2) ; also sheet 6

## Library data of the parts
C3 C4 C51 = tesis-master-smd:CP_: POLARIZED CAP
C5 = adafruit:CPOL-US: POLARIZED CAPACITOR, American symbol
C6 = tesis-master-smd:C_: NON-POLARIZED CAP
D1 = tesis-Replicape_B3:MBRA340T3: Surface Mount Schottky Power Rectifier Source: http://www.onsemi.com/pub_link/Collateral/MBRA340T3-D.PDF
D2 = adafruit:1N4004: DIODE General purpose 1N400x type rectifier (With bigger pads) http://www.ladyada.net/library/pcb/eaglelibrary.html
F1 F2 = tesis-Replicape_B3:FUSE: Fuse
J1-J3 J5 J12-J15 = tesis-Replicape_B3:22-?-02: CONNECTOR wire to board 2.54 mm (.1 inch) pitch header; OC_FARNELL: 9731601; OC_NEWARK: unknown
J16-J25 = tesis-Replicape_B3:22-?-03: CONNECTOR wire to board 2.54 mm (.1 inch) pitch header; OC_FARNELL: unknown; OC_NEWARK: unknown
JP1 JP8 = pinhead:PINHD-2X5: PIN HEADER
JP2-JP5 JP9 = pinhead:PINHD-1X8: PIN HEADER
JP6 = pinhead:PINHD-2X8: PIN HEADER
JP7 JP10 = pinhead:PINHD-1X6: PIN HEADER
JP11 = pinhead:PINHD-1X4: PIN HEADER
JP13 = pinhead:PINHD-2X18: PIN HEADER
JPE0 JPE1 JPX JPY JPZ = pinhead:PINHD-1X11: PIN HEADER
LED1-LED6 LED8-LED11 = tesis-Replicape_B3:LED: LED OSRAM: - CHIPLED LG R971, LG N971, LY N971, LG Q971, LY Q971, LO R971, LY R971 LH N974, LH R974 LS Q976, LO Q976, LY Q976 LO Q996 - Hyper CHIPLED LW Q18S LB Q993, LB Q99A, LB R99A - SideLED LS A670, LO A670, LY A670, LG A670, LP A670 LB A673, LV A673, LT A673, LW A673 LH A674 LY A675 LS A676, LA A676, LO A676, LY A676, LW A676 LS A679, LY A679, LG A679 - Hyper Micro SIDELED® LS Y876, LA Y876, LO Y876, LY Y876 LT Y87S - SmartLED LW L88C, LW L88S LB L89C, LB L89S, LG L890 LS L89K, LO L89K, LY L89K LS L896, LA L896, LO L896, LY L896 - TOPLED LS T670, LO T670, LY T670, LG T670, LP T670 LSG T670, LSP T670, LSY T670, LOP T670, LYG T670 LG T671, LOG T671, LSG T671 LB T673, LV T673, LT T673, LW T673 LH T674 LS T676, LA T676, LO T676, LY T676, LB T676, LH T676, LSB T676, LW T676 LB T67C, LV T67C, LT T67C, LS T67K, LO T67K, LY T67K, LW E67C LS E67B, LA E67B, LO E67B, LY E67B, LB E67C, LV E67C, LT E67C LW T67C LS T679, LY T679, LG T679 LS T770, LO T770, LY T770, LG T770, LP T770 LB T773, LV T773, LT T773, LW T773 LH T774 LS E675, LA E675, LY E675, LS T675 LS T776, LA T776, LO T776, LY T776, LB T776 LHGB T686 LT T68C, LB T68C - Hyper Mini TOPLED® LB M676 - Mini TOPLED Santana® LG M470 LS M47K, LO M47K, LY M47K Source: http://www.osram.convergy.de LUXEON: - LUMILED® LXK2-PW12-R00, LXK2-PW12-S00, LXK2-PW14-U00, LXK2-PW14-V00 LXK2-PM12-R00, LXK2-PM12-S00, LXK2-PM14-U00 LXK2-PE12-Q00, LXK2-PE12-R00, LXK2-PE12-S00, LXK2-PE14-T00, LXK2-PE14-U00 LXK2-PB12-K00, LXK2-PB12-L00, LXK2-PB12-M00, LXK2-PB14-N00, LXK2-PB14-P00, LXK2-PB14-Q00 LXK2-PR12-L00, LXK2-PR12-M00, LXK2-PR14-Q00, LXK2-PR14-R00 LXK2-PD12-Q00, LXK2-PD12-R00, LXK2-PD12-S00 LXK2-PH12-R00, LXK2-PH12-S00 LXK2-PL12-P00, LXK2-PL12-Q00, LXK2-PL12-R00 Source: www.luxeon.com KINGBRIGHT: KA-3528ASYC Source: www.kingbright.com
OK1 OK2 = optocoupler:TIL193: TEXAS INSTRUMENTS OPTO COUPLER; OC_FARNELL: 1683365; OC_NEWARK: unknown
Q3-Q5 = transistor-power:IRF512: N-CHANNEL MOS FET
R1-R4 R6-R9 R11-R16 R19-R33 R35-R39 = tesis-master-smd:R_: RESISTOR
U$2 U$3 = transistor-fet:DMN4031SSD
X1 = tesis-Replicape_B3:MSTBA4: PHOENIX; MF: FARNELL; MPN: 1757268; OC_FARNELL: 3705195; OC_NEWARK: 71C4163
X2-X4 = tesis-Replicape_B3:MSTBA2: PHOENIX; MF: FARNELL; MPN: 1757242; OC_FARNELL: 3705171; OC_NEWARK: 71C4161

## Board
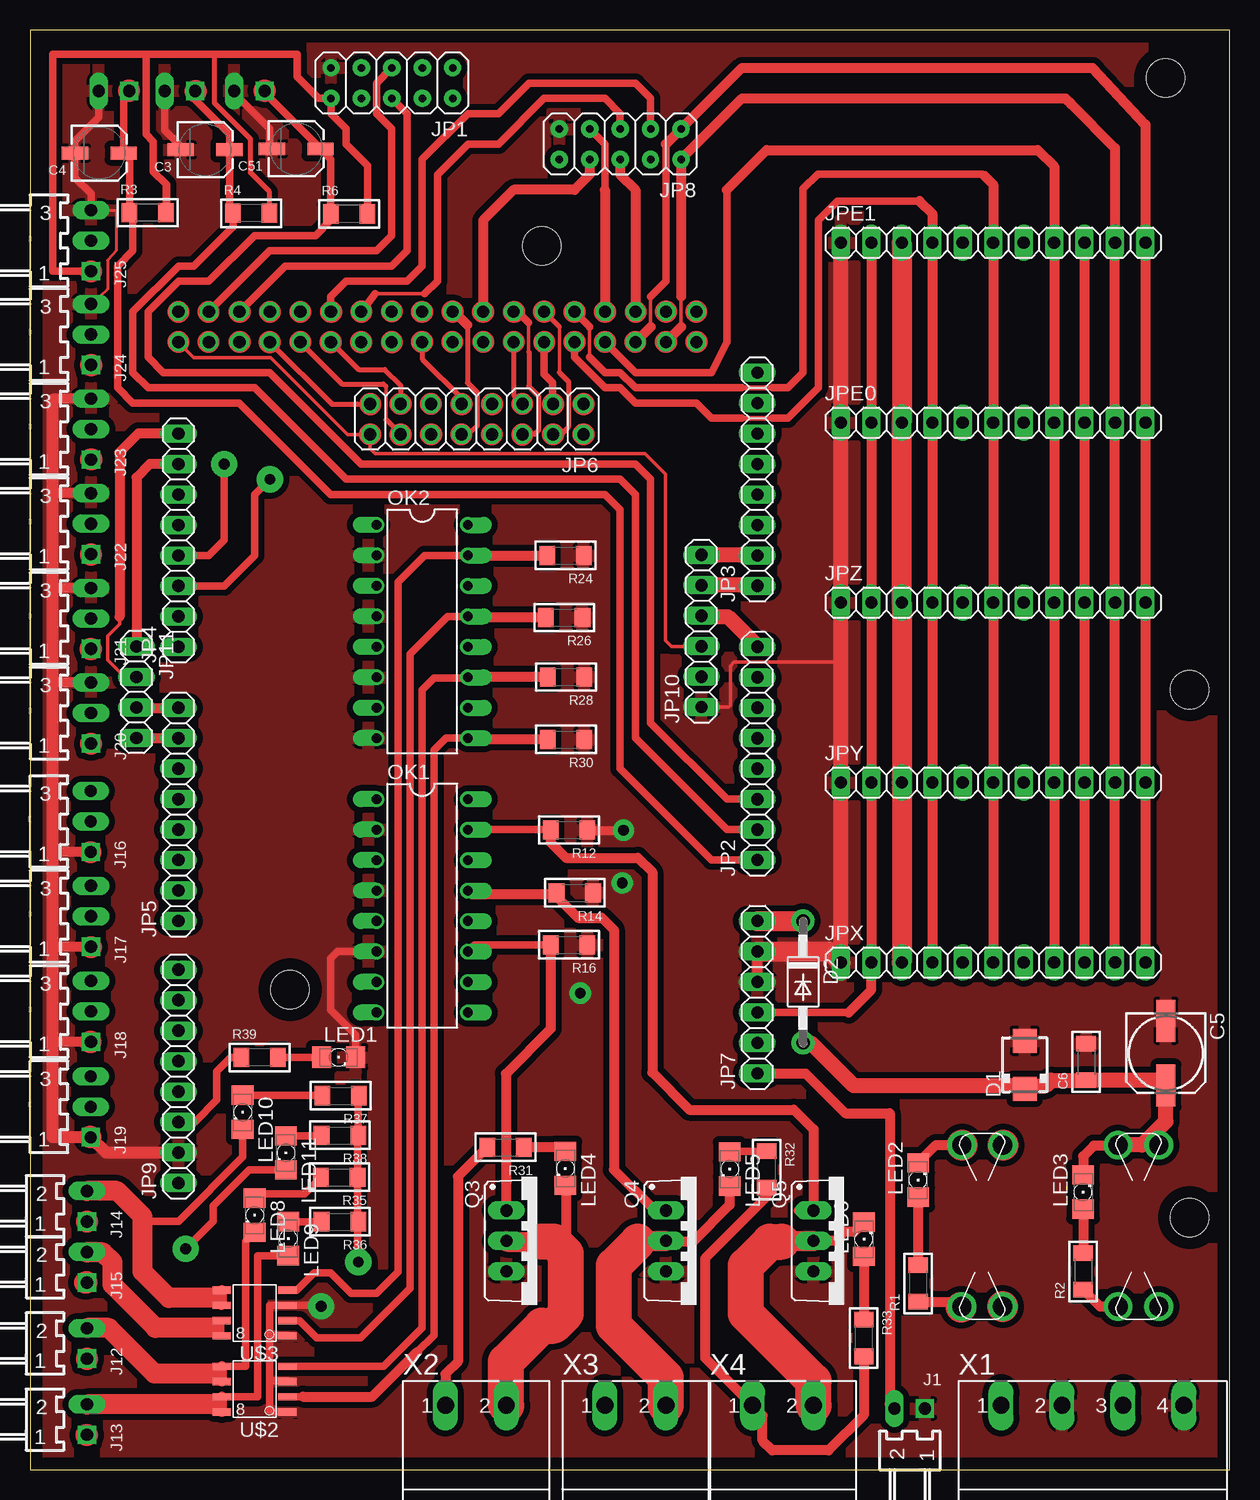
[diagram p7: board, top side]
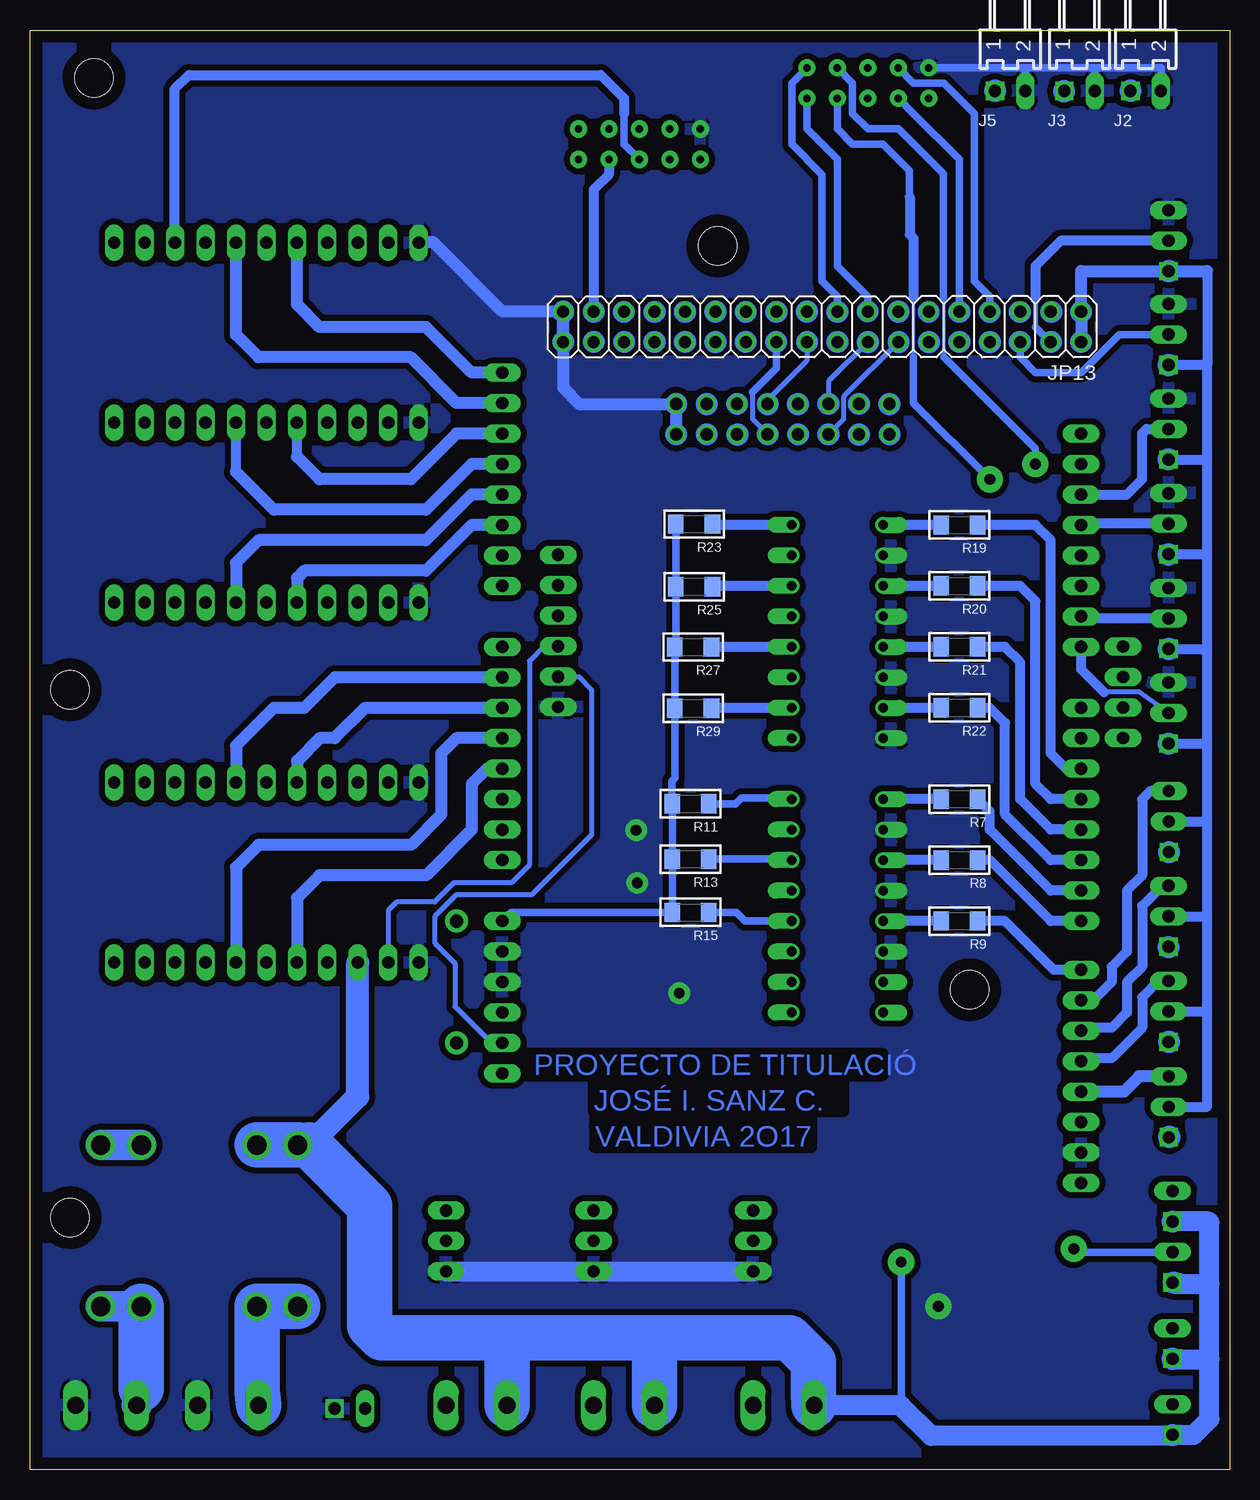
[diagram p8: board, bottom side, seen from below]

Size 100 x 120 mm. Coordinates in mm from the lower left corner, seen from the top.
Outline: 0,120 0,0 100,0 100,120 0,120
Copper layers (1*16): Top 0.035mm / dielectric 1.5mm / Bottom 0.035mm
Design rules "default *": minimum track width 10mil, minimum drill 24mil, track to track 0.5mm, track to pad 0.5mm, pad to pad 0.5mm, via to via 0.5mm, smd to smd 0.5mm, copper to edge 40mil, drill to drill 8mil, minimum pad ring 10mil, minimum via ring 8mil, stop-mask expansion 4mil, vias tented up to drill 0mil, thermal gap 10mil
Holes 3.2 mm at 94.67,116 96.67,65 21.67,40 42.67,102 96.67,21

### Footprints (pad centres in the part's own frame; a part is rotated, then mirrored left to right if it is on the bottom)
CSV-B = smd 2.184 x 1.067: + -2.032,0; - 2.032,0
153CLV-0605 = smd 3.5 x 1.6: + 2.7,0; - -2.7,0
C1206 = smd 1.3 x 1.6: 1 -1.524,0; 2 1.524,0
SMA = smd 2 x 2: A 2,0; C -2,0
DO41-10 = drill 1.118 pad 1.93: A 5.08,0; C -5.08,0
3557 = drill 1.6: P$1 -6.73,1.7; P$2 -6.73,-1.7; P$3 6.73,-1.7; P$4 6.73,1.7
7395-02 = drill 1.016 square: 1 1.27,0 | drill 1.016 long: 2 -1.27,0
7395-03 = drill 1.016 square: 1 2.54,0 | drill 1.016 long: 2 0,0; 3 -2.54,0
2X05 = drill 0.6 pad 1.422: 1 -5.08,-1.27; 2 -5.08,1.27; 3 -2.54,-1.27; 4 -2.54,1.27; 5 0,-1.27; 6 0,1.27; 7 2.54,-1.27; 8 2.54,1.27; 9 5.08,-1.27; 10 5.08,1.27
1X08 = drill 1.016 long: 1 -8.89,0; 2 -6.35,0; 3 -3.81,0; 4 -1.27,0; 5 1.27,0; 6 3.81,0; 7 6.35,0; 8 8.89,0
2X08 = drill 1.016 octagon: 1 -8.89,-1.27; 2 -8.89,1.27; 3 -6.35,-1.27; 4 -6.35,1.27; 5 -3.81,-1.27; 6 -3.81,1.27; 7 -1.27,-1.27; 8 -1.27,1.27; 9 1.27,-1.27; 10 1.27,1.27; 11 3.81,-1.27; 12 3.81,1.27; 13 6.35,-1.27; 14 6.35,1.27; 15 8.89,-1.27; 16 8.89,1.27
1X06 = drill 1.016 long: 1 -6.35,0; 2 -3.81,0; 3 -1.27,0; 4 1.27,0; 5 3.81,0; 6 6.35,0
1X04 = drill 1.016 long: 1 -3.81,0; 2 -1.27,0; 3 1.27,0; 4 3.81,0
2X18 = drill 1.016 octagon: 1 -21.59,-1.27; 2 -21.59,1.27; 3 -19.05,-1.27; 4 -19.05,1.27; 5 -16.51,-1.27; 6 -16.51,1.27; 7 -13.97,-1.27; 8 -13.97,1.27; 9 -11.43,-1.27; 10 -11.43,1.27; 11 -8.89,-1.27; 12 -8.89,1.27; 13 -6.35,-1.27; 14 -6.35,1.27; 15 -3.81,-1.27; 16 -3.81,1.27; 17 -1.27,-1.27; 18 -1.27,1.27; 19 1.27,-1.27; 20 1.27,1.27; 21 3.81,-1.27; 22 3.81,1.27; 23 6.35,-1.27; 24 6.35,1.27; 25 8.89,-1.27; 26 8.89,1.27; 27 11.43,-1.27; 28 11.43,1.27; 29 13.97,-1.27; 30 13.97,1.27; 31 16.51,-1.27; 32 16.51,1.27; 33 19.05,-1.27; 34 19.05,1.27; 35 21.59,-1.27; 36 21.59,1.27
1X11 = drill 1.016 long: 1 -12.7,0; 2 -10.16,0; 3 -7.62,0; 4 -5.08,0; 5 -2.54,0; 6 0,0; 7 2.54,0; 8 5.08,0; 9 7.62,0; 10 10.16,0; 11 12.7,0
1206 = smd 1.6 x 1.803: A -1.422,0; C 1.422,0
DIL16 = drill 0.813 offset: 1 -8.89,-3.81; 2 -6.35,-3.81; 3 -3.81,-3.81; 4 -1.27,-3.81; 5 1.27,-3.81; 6 3.81,-3.81; 7 6.35,-3.81; 8 8.89,-3.81; 9 8.89,3.81; 10 6.35,3.81; 11 3.81,3.81; 12 1.27,3.81; 13 -1.27,3.81; 14 -3.81,3.81; 15 -6.35,3.81; 16 -8.89,3.81
TO220BV = drill 1.016 long: D 0,-2.54; G -2.54,-2.54; S 2.54,-2.54
R1206 = smd 1.3 x 1.6: 1 -1.524,0; 2 1.524,0
DMN4031SSD = smd 1.524 x 0.61: 1 -0.203,5.715; 2 -0.203,4.445; 3 -0.203,3.175; 4 -0.203,1.905; 5 5.283,1.905; 6 5.283,3.175; 7 5.283,4.445; 8 5.283,5.715
MSTBA4 = drill 1.397 long: 1 -7.62,5.08; 2 -2.54,5.08; 3 2.54,5.08; 4 7.62,5.08
MSTBA2 = drill 1.397 long: 1 -2.54,5.08; 2 2.54,5.08

### Placement (x,y rotation side)
C3  14.59,110.01 180 top
C4  5.77,109.74 180 top
C5  94.69,34.71 270 top
C6  88.04,33.98 90 top
C51  22.19,110.09 180 top
D1  82.92,33.74 90 top
D2  64.44,40.64 270 top
F1  79.38,20.32 90 top
F2  92.41,20.32 90 top
J1  73.33,5.08 0 top
J2  6.99,114.92 180 bottom
J3  12.5,114.92 180 bottom
J5  18.28,114.92 180 bottom
J12  4.75,10.51 270 top
J13  4.75,4.16 270 top
J14  4.75,21.94 270 top
J15  4.75,16.86 270 top
J16  5.06,54.02 270 top
J17  5.08,46.12 270 top
J18  5.08,38.18 270 top
J19  5.06,30.24 270 top
J20  5.08,63.06 270 top
J21  5.08,70.95 270 top
J22  5.08,78.84 270 top
J23  5.08,86.73 270 top
J24  5.08,94.62 270 top
J25  5.08,102.43 270 top
JP1  30.16,115.57 180 top
JP2  60.63,59.69 90 top
JP3  60.63,82.55 90 top
JP4  12.37,77.47 90 top
JP5  12.37,54.61 90 top
JP6  37.24,87.56 180 top
JP7  60.63,39.37 90 top
JP8  49.2,110.48 180 top
JP9  12.37,32.77 90 top
JP10  55.97,69.9 90 top
JP11  8.87,64.8 270 top
JP13  33.96,95.26 180 bottom
JPE0  80.29,87.27 0 top
JPE1  80.29,102.27 0 top
JPX  80.29,42.27 0 top
JPY  80.29,57.27 0 top
JPZ  80.29,72.27 0 top
LED1  25.72,34.37 0 top
LED2  74.03,24.13 90 top
LED3  87.79,23.13 90 top
LED4  44.62,25.1 270 top
LED5  58.32,25.05 270 top
LED6  69.52,19.2 90 top
LED8  18.72,21.2 270 top
LED9  21.52,19.25 270 top
LED10  17.72,29.78 270 top
LED11  21.32,26.4 270 top
OK1  32.69,46.99 270 top
OK2  32.69,69.85 270 top
Q3  42.25,19.05 270 top
Q4  55.55,19.05 270 top
Q5  67.85,19.05 270 top
R1  74.03,15.51 90 top
R2  87.79,16.51 90 top
R3  9.81,104.77 0 top
R4  18.44,104.72 0 top
R6  26.6,104.67 0 top
R7  22.53,55.88 180 bottom
R8  22.53,50.8 180 bottom
R9  22.53,45.72 180 bottom
R11  44.93,55.5 180 bottom
R12  44.93,53.31 180 top
R13  44.93,50.88 180 bottom
R14  45.41,48.07 180 top
R15  44.93,46.45 180 bottom
R16  44.93,43.74 180 top
R19  22.53,78.74 180 bottom
R20  22.53,73.66 180 bottom
R21  22.53,68.58 180 bottom
R22  22.53,63.5 180 bottom
R23  44.63,78.81 180 bottom
R24  44.63,76.2 180 top
R25  44.63,73.59 180 bottom
R26  44.53,71.02 180 top
R27  44.71,68.56 180 bottom
R28  44.68,66.06 180 top
R29  44.71,63.46 180 bottom
R30  44.68,60.86 180 top
R31  39.63,26.86 180 top
R32  61.41,25.01 270 top
R33  69.51,10.96 270 top
R35  25.78,24.36 180 top
R36  25.83,20.66 180 top
R37  25.88,31.16 180 top
R38  25.83,27.86 180 top
R39  19.14,34.35 0 top
U$2  21.26,10.51 180 top
U$3  21.26,16.86 180 top
X1  88.57,0.27 0 top
X2  37.17,0.27 0 top
X3  50.47,0.27 0 top
X4  62.77,0.27 0 top

### Tracks (layer width: path | path; a pad name or v marks a point on that pad's centre or on a via)
3.3V_SYS
  Bottom 0.406: JP10.2 54.26,66.09 53.17,65 53.17,52.9 58.17,47.9 64.47,47.9 66.27,46.1 66.27,43.9 64.57,42.2 64.57,38.6 61.53,35.56 JP7.2
5V_SYS
  Top 0.305: JP13.2 13.66,92.7 20.07,92.7 26.48,86.29 JP6.16 28.35,85.12 28.77,84.7 51.27,84.7 52.97,83 52.97,69.1 53.47,68.6 55.94,68.6 JP10.3
  Top 0.406: R4.2 19.96,106.51 18.37,108.1 18.37,110.9 15.37,113.9 15.37,118 15.47,118
  Top 0.61: JP7.3 68.25,38.1 | R6.2 28.12,108.71 26.34,110.49 26.34,111.76 25.08,113.02 JP1.10 24.07,114.3 22.27,116.1 22.27,118 15.47,118 9.67,118 | 11.33,107.14 R3.2 11.37,104.77 11.37,107.1 11.33,107.14 | 11.33,107.14 10.27,108.2 10.27,110.7 9.67,111.3 9.67,118 | 9.67,118 1.87,118 1.87,99.9 J25.1
  Top 0.813: JPE1.2 JPE0.2 JPZ.2 JPY.2 JPX.2 70.13,39.98 68.25,38.1
  Bottom 0.406: JP10.3 57.14,68.63 58.37,67.4 58.37,50.4 59.87,48.9 64.67,48.9 66.27,47.3 69.43,47.3 70.13,46.6 JPX.2
  Bottom 0.813: 1.87,99.9 1.87,92.08 | 1.87,92.08 J24.1 | J23.1 1.87,84.19 | 1.87,84.19 1.87,92.08 | J22.1 1.87,76.3 | 1.87,76.3 1.87,84.19 | J21.1 1.87,68.41 | 1.87,68.41 1.87,76.3 | J20.1 1.87,60.52 | 1.87,60.52 1.87,68.41 | J16.2 1.87,54.02 | 1.87,54.02 1.87,60.52 | J17.2 1.87,46.12 | 1.87,46.12 1.87,54.02 | J18.2 1.87,38.18 | 1.87,38.18 1.87,46.12 | J19.2 1.87,30.24 1.87,38.18
  Bottom 1.016: 12.37,99.89 JP13.1 JP13.2 | 12.37,99.89 J25.1 | 12.37,99.89 12.37,99.9 1.87,99.9
12V_IN1
  Top 0.813: R1.1 77.28,13.99 F1.P$1
  Bottom 3.81: X1.1 81.08,6.48 F1.P$2 F1.P$1
12V_IN2
  Top 0.813: R2.1 89.19,13.59 F2.P$1
  Bottom 2.54: X1.3 90.71,6.75 | F2.P$1 F2.P$2
  Bottom 3.81: 90.71,6.75 F2.P$1
12V_VCC  (via drill 0.9 pad 2.18)
  Top 0.61: R37.1 27.35,31.11 R38.1 27.3,27.81 R35.1 | R35.1 27.3,20.71 R36.1 | R35.1 27.3,17.37 v27.37,17.3
  Top 0.813: LED2.C 75.53,27.05 F1.P$4 | R31.2 35.67,24.42 35.67,9 34.63,7.96 X2.1 | R32.2 61.41,22.74 56.27,17.6 56.27,9.31 X4.1 61.07,4.51 61.07,2.4 61.87,1.6 66.57,1.6 69.51,4.54 R33.2
  Top 1.676: JPE1.3 JPE0.3 JPZ.3 JPY.3 JPX.3
  Bottom 0.61: v27.37,17.3 27.37,5.3 27.32,5.25
  Bottom 1.676: X2.1 27.42,5.35 27.32,5.25 24.87,2.8 4.84,2.8 J13.1 2.98,2.89 1.67,4.2 1.67,9.2 | 1.67,9.2 1.67,15.5 | 1.67,15.5 1.67,20.6 1.74,20.67 J14.1 | J15.1 4.66,15.5 1.67,15.5 | J12.1 4.71,9.2 1.67,9.2
  Bottom 1.93: 76.72,27.05 72.67,31.1 JPX.3 | 76.72,27.05 76.67,27.05 | 76.72,27.05 F1.P$4
  Bottom 3.81: F1.P$4 F1.P$3 | 76.72,27.05 71.67,22 71.67,12 70.67,11 60.23,11 | 60.23,11 47.93,11 | 47.93,11 36.67,11 34.67,9 34.67,6.39 X2.1 | X3.1 47.93,11 | X4.1 60.23,11
A0
  Top 0.61: J2.1 arc90 7.8,114.46 C4.+ 8.29,109.26 R3.1 8.56,104.5 8.56,101.6 7.29,100.33 7.29,90.17 8.56,88.9 17.45,88.9 25.07,81.28 47.93,81.28 49.2,80.01 49.2,58.42 56.82,50.8 JP2.1
A1
  Top 0.61: J3.1 13.77,114.17 16.62,111.32 C3.+ 16.62,105.01 arc90 R4.1 16.92,103.61 13.64,100.33 12.37,100.33 8.56,96.52 8.56,91.44 9.83,90.17 18.72,90.17 26.34,82.55 49.2,82.55 50.47,81.28 50.47,60.96 58.09,53.34 JP2.2
A2
  Top 0.61: J5.1 19.55,114.76 C51.+ 25.08,109.24 R6.1 25.08,104.15 23.8,102.87 18.72,102.87 14.91,99.06 12.37,99.06 9.83,96.52 9.83,92.71 11.1,91.44 19.99,91.44 27.61,83.82 50.47,83.82 51.74,82.55 51.74,62.23 58.09,55.88 JP2.3
A7
  Top 1.27: JP10.4 56.04,71.1 58.17,71.1 60.63,68.64 JP2.8
A8
  Top 1.27: JP3.1 60.58,73.71 JP10.5
A9
  Top 1.27: JP3.2 60.58,76.25 JP10.6
BUSY
  Top 0.61: 58.09,106.68 58.09,93.98 56.82,91.44 50.47,91.44 JP13.30
  Top 0.813: JPZ.8 JPE0.8 JPE1.8 85.37,108.64 84.01,110 61.41,110 58.09,106.68 | 85.37,71.79 JPZ.8 | JPZ.8 JPY.8 JPX.8
CS_E0
  Bottom 0.813: 82.83,83.16 JPE0.7
  Bottom 1.016: JP3.5 63.17,83.82 66.98,80.01 79.68,80.01 82.83,83.16
CS_E1
  Bottom 1.016: JP3.7 64.44,88.9 68.25,92.71 80.95,92.71 82.83,94.59 JPE1.7
CS_SD
  Bottom 0.813: JP8.4 51.74,107.95 53.01,106.68 JP13.33
CS_X
  Bottom 1.016: JP2.5 64.44,60.96 65.71,59.69 65.71,54.61 68.25,52.07 80.95,52.07 82.83,50.19 JPX.7
CS_Y
  Bottom 1.016: JP2.7 74.6,66.04 77.14,63.5 79.68,63.5 82.83,60.35 JPY.7
CS_Z
  Bottom 1.016: JP3.4 63.17,81.28 66.98,77.47 80.95,77.47 82.83,75.59 JPZ.7
D0
  Top 0.813: JP11.3 8.9,63.5 JP5.8
D1
  Top 0.813: JP11.4 8.9,60.96 JP5.7
D2
  Bottom 0.813: JP5.6 13.64,58.42 14.91,59.69 14.91,77.47 16.18,78.74 R19.1 21.26,78.74
D3
  Bottom 0.813: JP5.5 14.91,55.88 16.18,57.15 16.18,72.39 17.45,73.66 R20.1
D4
  Bottom 0.813: JP5.4 14.91,53.34 17.45,55.88 17.45,67.31 18.72,68.58 R21.1
D5
  Bottom 0.813: JP5.3 14.91,50.8 18.72,54.61 18.72,62.23 19.99,63.5 R22.1
D6
  Bottom 0.813: JP5.2 14.91,48.26 19.99,53.34 19.99,54.86 R7.1
D7
  Bottom 0.813: JP5.1 14.91,45.72 19.99,50.8 R8.1
D8
  Bottom 0.813: JP9.8 14.66,41.66 18.72,45.72 R9.1
D9
  Bottom 0.813: J16.3 6.61,56.56 7.29,55.88 7.29,49.53 8.56,48.26 8.56,43.18 9.83,41.91 9.83,40.64 11.1,39.37 12.12,39.37 JP9.7
D10
  Bottom 0.813: J17.3 5.62,48.66 7.29,46.99 7.29,41.91 8.56,40.64 8.56,38.1 9.83,36.83 12.12,36.83 JP9.6
D11
  Bottom 0.813: J18.3 5.94,40.72 7.29,39.37 7.29,36.83 9.83,34.29 12.12,34.29 JP9.5
D12
  Bottom 1.016: J19.3 7.53,32.78 8.81,31.5 JP9.4
D13
  Top 0.61: R39.1 16.72,34.35 15.57,33.2 15.57,30.8 13.77,29 12.41,29 JP9.3
D14
  Bottom 0.406: J20.2 7.52,64.8 10.47,64.8
  Bottom 0.813: 10.47,64.8 12.37,66.7 JP4.1
D15
  Bottom 0.813: J21.2 12.2,70.95 JP4.2
D16  (via drill 0.9 pad 2.18)
  Top 0.61: v19.99,82.55 18.72,81.28 18.72,76.2 16.18,73.66 JP4.3
  Bottom 0.305: 26.34,92.73 26.34,97.65 26.32,97.67 | 26.66,106.08 26.67,106.09
  Bottom 0.61: JP1.4 32.7,111.77 31.42,110.49 28.88,110.49 26.67,108.28 26.67,106.09 | v19.99,82.55 26.34,88.9 26.34,92.73
  Bottom 0.813: 26.32,97.67 26.32,102.61 26.66,102.95 26.66,106.08
D17  (via drill 0.9 pad 2.18)
  Top 0.61: v16.18,83.82 16.18,77.47 14.91,76.2 JP4.4
  Bottom 0.305: 23.8,92.71 23.8,97.63 23.87,97.7
  Bottom 0.61: JP1.3 31.42,115.57 31.42,113.03 30.15,111.76 27.61,111.76 23.87,108.02 23.87,97.7 | 23.8,92.71 16.18,85.09 v16.18,83.82
D18
  Bottom 0.813: J22.2 12.27,78.84 JP4.5
D19
  Bottom 0.813: JP4.6 8.56,81.28 7.29,82.55 7.29,86.36 6.92,86.73 J23.2
D20
  Top 0.813: JP4.7 9.99,83.82 8.87,82.7 JP11.1
D21
  Top 0.305: 7.47,71.1 7.47,70.5 6.47,69.5 6.47,67.5 7.9,66.07 JP11.2
  Top 0.813: JP4.8 9.03,86.36 7.47,84.8 7.47,71.1
D22
  Bottom 0.406: 16.18,97.79 16.18,95.25
  Bottom 0.61: 16.18,95.25 16.17,95.25 JP13.4
  Bottom 0.813: J25.2 14.08,102.43 16.18,100.33 16.18,97.79
D23
  Top 0.61: JP1.5 28.88,115.57 28.88,113.03 30.15,111.76 30.15,102.87 28.88,101.6 19.99,101.6 17.45,99.06 17.44,99.06 JP13.3
D24
  Bottom 0.61: J24.2 9.19,94.62 12.37,91.44 16.18,91.44 17.45,92.71 JP13.6
D25
  Top 0.61: JP13.5 18.71,97.79 18.72,97.79 21.26,100.33 30.15,100.33 31.42,101.6 31.42,113.04 JP1.6
D26
  Top 0.406: JP13.8 25.18,88.8 27.27,88.8 27.3,88.83 JP6.15
D27
  Bottom 0.61: JP13.7 19.99,97.79 21.26,99.06 21.26,113.03 23.8,115.57 26.35,115.57 JP1.7
D28
  Top 0.305: 29.67,90.3 29.67,87.51
  Top 0.406: JP13.10 26.02,90.5 29.47,90.5 29.67,90.3 | 29.67,87.51 JP6.14
D29
  Bottom 0.61: JP1.8 26.35,113.03 26.34,113.03 22.53,109.22 JP13.9
D30
  Top 0.406: JP13.12 27.37,91.7 29.57,91.7 30.87,90.4 30.87,88.85 JP6.13
D31
  Top 0.61: JP13.11 25.07,97.79 26.34,99.06 31.42,99.06 32.69,100.33 32.69,109.22 36.5,113.03 39.04,113.03 41.58,115.57 50.47,115.57 51.74,114.3 JP8.3
D32
  Bottom 0.406: JP13.14 32.17,89.43 32.17,87.55 JP6.12
D33
  Top 0.305: 28.76,98.03 32.91,98.04
  Top 0.61: JP13.13 28.76,98.03 | 32.91,98.04 33.96,99.06 33.96,107.95 36.5,110.49 39.04,110.49 42.85,114.3 47.93,114.3 49.2,113.03 JP8.5
D34
  Bottom 0.406: JP13.16 33.43,90.71 JP6.11
D35
  Bottom 0.61: JP13.15 30.15,97.79 32.69,100.33 32.69,109.22 35.23,111.76 JP1.2
D36
  Top 0.406: JP13.18 32.69,92.58 35.97,89.3 JP6.9
D37
  Bottom 0.61: JP1.1 36.5,115.57 36.5,110.49 33.96,107.95 33.96,99.06 32.69,97.79 JP13.17
D38
  Bottom 0.406: JP13.20 35.23,92.44 38.51,89.16 JP6.7
D39
  Top 0.406: 36.47,95.4 36.47,90.6 37.27,89.8 37.27,87 36.57,86.3 JP6.10
  Top 0.813: JP13.19 35.34,96.53 36.47,95.4
D40
  Bottom 0.406: 39.77,89.8 39.77,87.55 JP6.8
  Bottom 0.61: JP13.22 37.77,91.8 39.77,89.8
D41
  Top 0.813: JP8.8 46.66,107.95 45.39,106.68 40.31,106.68 37.77,104.14 JP13.21
D42
  Top 0.406: JP13.24 40.31,89.57 JP6.5
D43
  Top 0.305: 41.57,95.6 41.57,93.19 41.59,93.17
  Top 0.406: JP6.6 42.07,86.3 42.37,86.6 42.37,89.5 41.57,90.3 41.59,90.32 41.59,93.17
  Top 0.61: JP13.23 40.64,96.53 41.57,95.6
D44
  Top 0.61: JP13.26 42.85,91.32 43.57,90.6 43.57,88.85 JP6.3
D45
  Top 0.305: 44.12,95.26 44.12,91.44
  Top 0.406: JP13.25 44.12,95.26 | 44.12,91.44 44.87,90.69 44.87,86.9 44.26,86.29 JP6.4
D49
  Top 0.61: JP8.7 47.93,110.49 47.93,106.68
  Top 0.813: 47.93,106.68 JP13.29
E0_STEP
  Bottom 0.813: 77.75,84.43 JPE0.5
  Bottom 1.016: JP3.6 64.44,86.36 68.25,82.55 75.87,82.55 77.75,84.43
E1_STEP
  Bottom 1.016: JP3.8 63.17,91.44 66.98,95.25 75.87,95.25 77.75,97.13 JPE1.5
FLAG
  Top 0.305: 46.66,95.25 46.66,92.71
  Top 0.406: 59.36,90.17 61.9,90.17
  Top 0.61: JP13.27 46.66,95.26 46.66,95.25 | 61.9,90.17 63.17,90.17 64.44,91.44 64.44,106.77 65.67,108 79.41,108 79.56,107.85 | 46.66,92.71 47.93,91.44 49.2,91.44 50.47,90.17 59.36,90.17
  Top 0.813: 79.56,107.85 80.29,107.12 JPE1.6 JPE0.6 JPZ.6 JPY.6 JPX.6
GND  (via drill 0.9 pad 1.78, 0.9 pad 2.18)
  Top 0.254: J25.3 7.17,104.97 7.17,101.6 6.47,100.8 6.47,98.4 5.13,97.16 J24.3
  Top 0.305: JP10.1 58.22,63.55 58.37,63.7 58.37,67 58.67,67.3 67.49,67.3 67.59,67.4
  Top 0.61: LED1.C 27.14,36.23 25.07,38.3 25.07,42.6 25.65,43.18 OK1.6 | U$2.1 19.97,4.79 19.97,7.4 | 19.97,7.4 19.97,11.2 | 19.97,11.2 19.97,13.69 U$3.3 24.19,13.69 v24.27,13.6 | U$3.1 21.46,11.2 19.97,11.2 | U$2.3 21.46,7.4 19.97,7.4 | J2.2 5.72,112.73 3.74,110.75 C4.- 3.74,107.69 5.08,106.35 J25.3 | J3.2 11.23,111.63 12.37,110.49 12.37,110.2 C3.- | C51.- 19.99,110.26 19.99,111.76 17.01,114.74 J5.2 | R12.1 46.46,53.3 v49.47,53.3 49.57,53.3 49.47,53.2 46.67,53.2
  Top 0.813: JP7.4 JP7.5 | J18.1 1.87,35.64 1.87,35.56 | J17.1 1.87,43.58 1.87,44.45 | J16.1 1.87,51.48 1.87,52.07 | J20.3 1.87,65.6 1.87,66.04 | J21.3 1.87,73.49 1.87,73.66 | J22.3 1.87,81.38 1.87,81.28 | J23.3 1.87,89.27 1.87,88.9
  Top 1.016: JP9.2 6.34,26.42 J19.1 1.87,27.7 1.87,35.56 1.87,44.45 1.87,52.07 1.87,66.04 1.87,73.66 1.87,81.28 1.87,88.9
  Top 1.27: JPX.1 JPY.1 67.59,67.4 JPZ.1 JPE0.1 JPE1.1
  Top 1.676: JP7.5 66.68,43.18 JPX.1
  Bottom 0.61: v24.27,13.6 24.97,13.6 25.07,13.7 | JP1.9 17.07,116.84 | 17.07,116.84 11.37,116.84 | 11.37,116.84 5.71,116.84 5.67,116.8 5.67,114.97 J2.2 | J3.2 11.23,116.7 11.37,116.84 | J5.2 17.01,116.78 17.07,116.84
  Bottom 1.016: JP13.36 JP13.35 | JP13.35 60.6,96.53 66.37,102.3 67.56,102.3 JPE1.1 | JP13.35 55.55,90.17 54.21,88.83 JP6.1 JP6.2
  Bottom 1.676: Q5.S Q4.S Q3.S
  other vias: 45.87,39.7 49.37,48.9
  pour Top: -0.33,0 99.67,0 99.67,120 -0.33,120
  pour Bottom: -0.33,0 99.67,0 99.67,120 -0.33,120
MISO
  Top 0.305: 51.74,95.25 51.74,97.79
  Top 0.61: 53.01,110.49 53.01,99.06 51.74,97.79
  Top 0.813: JPX.11 JPY.11 JPZ.11 JPE0.11 JPE1.11 92.99,112.12 88.57,116.84 | 88.56,116.83 88.57,116.84 | JP13.32 51.74,95.25 | 53.01,110.49 JP8.1 59.36,116.84 88.57,116.84
MOSI
  Top 0.813: JPE1.9 JPE0.9 JPZ.9 JPY.9 JPX.9 | JP8.6 49.2,107.95 50.47,106.68 JP13.31
  Bottom 0.61: 50.47,113.03 50.47,110.48 JP8.6
  Bottom 0.813: JPE1.9 87.96,102.32 87.96,115.05 86.77,116.24 52.41,116.24 50.47,114.3 50.47,113.03
N$1
  Top 0.61: LED11.A 24.27,27.82 R38.2
N$2
  Top 0.61: R39.2 24.28,34.35 LED1.A
N$4
  Top 0.813: LED2.A R1.2
N$6
  Top 0.813: LED3.A R2.2
N$8
  Top 0.813: LED6.C 68.7,19.8 67.87,19.8 67.12,19.05 Q5.D | 62.72,19.05 62.67,19
  Top 1.676: 62.72,19.05 Q5.D
  Top 3: X4.2 65.31,7.36 59.67,13 59.67,17 61.67,19 62.67,19
N$9
  Top 0.813: F2.P$4 90.66,27 88.67,27 87.79,26.12 LED3.C
  Top 1.27: D2.A 65.11,35.56 68.67,32 82.66,32 D1.C 83.18,32 84.67,32 85.13,32.46 C6.1 94.24,32.46 C5.+ 94.69,29.02 92.72,27.05 F2.P$4
  Bottom 0.813: F2.P$4 90.76,27
  Bottom 2.54: F2.P$4 F2.P$3
N$10
  Bottom 0.813: R7.2 OK1.1
N$11
  Bottom 0.813: R8.2 OK1.3
N$12
  Bottom 0.813: R9.2 OK1.5
N$14
  Bottom 0.61: OK1.16 arc-90 36.62,56 40.67,56 41.17,55.5 R11.1
N$15
  Bottom 0.61: OK1.14 36.58,50.88 R13.1
N$16
  Bottom 0.61: OK1.12 40.39,45.72 41.12,46.45 R15.1
N$18
  Bottom 0.813: R19.2 OK2.1
N$19
  Bottom 0.813: R20.2 OK2.3
N$20
  Bottom 0.813: R21.2 OK2.5
N$21
  Bottom 0.813: R22.2 OK2.7
N$22
  Bottom 0.813: OK2.16 43.04,78.74 R23.1
N$23
  Bottom 0.813: OK2.14 43.04,73.66 R25.1
N$24
  Bottom 0.813: OK2.12 43.17,68.58 R27.1
N$25
  Bottom 0.813: OK2.10 43.15,63.5 R29.1
N$26
  Top 0.813: LED4.A 44.28,26.86 R31.1
N$27
  Top 0.813: LED5.C 58.32,22.05 55.27,19 53.06,19 Q4.D
  Top 1.676: 50.67,19 50.72,19.05 Q4.D
  Top 3: X3.2 53.01,7.66 48.67,12 48.67,17 50.67,19
N$28
  Top 0.61: LED5.A 58.38,26.53 R32.1
N$29  (via drill 0.9 pad 2.18)
  Top 0.254: U$3.7 U$3.8
  Top 0.406: U$3.7 15.97,11.2 15.87,11.3 15.87,11.8 15.37,11.8
  Top 0.61: LED11.C 18.25,24.98 15.27,22 15.27,20.7 v12.97,18.4
  Top 1.676: 15.37,11.8 10.47,11.8 6.87,15.4 6.87,17.3 6.07,18.1 4.78,18.1 J15.2
  Bottom 0.61: v12.97,18.4 12.67,18.1 5.27,18.1 5.24,18.13 J15.2
N$30
  Top 0.813: LED6.A 69.51,17.77 R33.1
N$33
  Top 0.61: LED9.A R36.2
N$34
  Top 0.61: LED9.C 18.97,17.83 18.97,6.07 U$2.7
  Top 0.813: U$2.8 U$2.7 15.41,5.5 15.37,5.5
  Top 1.676: 15.37,5.5 15.3,5.43 J13.2
N$35
  Top 0.61: LED8.A 18.72,23 22.9,23 R35.2
N$36
  Top 0.254: U$3.6 U$3.5
  Top 0.61: LED10.C 17.72,26.05 12.37,20.7 9.47,20.7 9.37,20.8
  Top 0.813: U$3.5 15.97,13.7 15.97,14.3 15.37,14.3
  Top 1.676: 15.37,14.3 11.57,14.3 9.37,16.5 9.37,20.8 9.37,21.1 7.26,23.21 J14.2
N$39
  Top 0.61: LED8.C 17.97,19.03 17.97,8.61 U$2.5
  Top 0.813: U$2.6 U$2.5 15.98,8.51 15.47,8
  Top 1.676: 15.47,8 10.37,8 6.57,11.8 4.77,11.8 J12.2
N$42
  Top 0.61: LED10.A 24.31,31.2 R37.2
N$66
  Top 0.813: LED4.C 44.67,23.63 44.67,19 44.17,18.5
  Top 1.676: Q3.D 39.76,19 42.67,19
  Top 3: X2.2 39.67,5.39 39.67,9 42.67,12 43.67,12 44.67,13 44.67,18 44.17,18.5 43.67,19 42.67,19
RESET
  Top 0.406: 59.36,87.63 61.9,87.63
  Top 0.61: 59.36,87.63 56.82,87.63 55.55,88.9 50.47,88.9 49.2,90.17 47.93,90.17 45.39,92.71 JP13.28 | 61.9,87.63 63.17,87.63 65.71,90.17 65.71,104.14 67.32,105.75 74.16,105.75
  Top 0.813: 74.16,105.75 75.21,104.7 JPE1.4 JPE0.4 JPZ.4 JPY.4 JPX.4
RESET_1
  Top 0.813: JP7.1 64.65,33.02 67.97,29.7 71.67,29.7 71.67,5.47 J1.2
SCK
  Top 0.305: 54.28,95.25 54.28,97.79
  Top 0.813: JPX.10 JPY.10 JPZ.10 JPE0.10 JPE1.10 90.45,110.16 86.81,113.81 86.32,114.29 86.31,114.3 59.36,114.3 JP8.2 54.28,97.79 | JP13.34 54.28,95.25
V_GS1
  Top 0.61: R12.2 43.38,53.34 OK1.15
  Top 0.813: R12.2 43.41,52.26 44.67,51 50.67,51 51.87,49.8 51.87,33.1 54.97,30 63.67,30 65.31,28.36 Q5.G 64.08,21.59
V_GS2
  Top 0.61: 43.67,48 43.74,48.07 R14.2
  Top 0.813: OK1.13 36.76,48 43.67,48 45.67,46 47.67,46 48.67,45 48.67,25 52.08,21.59 Q4.G
V_GS3
  Top 0.61: OK1.11 37.06,43.74 R16.2
  Top 0.813: R16.2 43.41,36.74 39.67,33 39.67,21.63 Q3.G
V_GS_FAN1
  Top 0.61: OK2.11 36.46,66 33.67,66 32.67,65 32.67,11.8 29.48,8.61 U$2.4
  Top 0.813: R28.2 36.52,66.06 OK2.11
V_GS_FAN2
  Top 0.61: U$2.2 22.74,6.07 | OK2.9 36.46,61 34.67,61 33.67,60 33.67,11.2 32.27,9.8
  Top 0.813: R30.2 36.6,60.86 OK2.9 | 22.74,6.07 28.54,6.07 32.27,9.8
V_GS_FAN3
  Top 0.61: OK2.15 32.87,76.2 30.67,74 30.67,16.5 28.87,14.7 26.77,14.7 25.07,16.4 23.67,16.4 22.23,14.96 U$3.4
  Top 0.813: OK2.15 R24.2
V_GS_FAN4
  Top 0.61: OK2.13 34.79,71.12 31.67,68 31.67,15.1 27.57,11 23.87,11 22.46,12.41 U$3.2
  Top 0.813: R26.2 36.6,71.02 OK2.13
V_IN
  Top 1.676: JP7.6 D2.C
  Bottom 0.61: JP7.6 59.9,46.45 R15.2 R13.2 R11.2 46.47,55.52 46.47,57.4 46.23,57.64 R29.2 R27.2 46.15,68.64 R25.2 R23.2
X_STEP
  Bottom 1.016: JP2.4 61.9,58.42 63.17,57.15 63.17,53.34 66.98,49.53 75.87,49.53 77.75,47.65 JPX.5
Y_STEP
  Bottom 1.016: JP2.6 72.06,63.5 74.6,60.96 75.87,60.96 77.75,59.08 JPY.5
Z_STEP
  Bottom 1.016: JP3.3 63.17,78.74 66.98,74.93 77.14,74.93 77.75,74.32 JPZ.5
(copper drawn outside any net)
  shapes: Bottom circle x73, Top circle x74

### Text on the board
Bottom: PROYECTO DE TITULACIÓ | JOSÉ I. SANZ C. | VALDIVIA 2O17